# Altium project RK3576J-MB.PrjPCB (part 3 of 7)

## Sheet PWR_PoE_PD_1000BASE-T.SchDoc
size 420 x 297 mm; SheetNumber: 4; SheetTotal: 32; DocumentTypeShort: Э3; DocumentInvertoryNumber: ㅤ
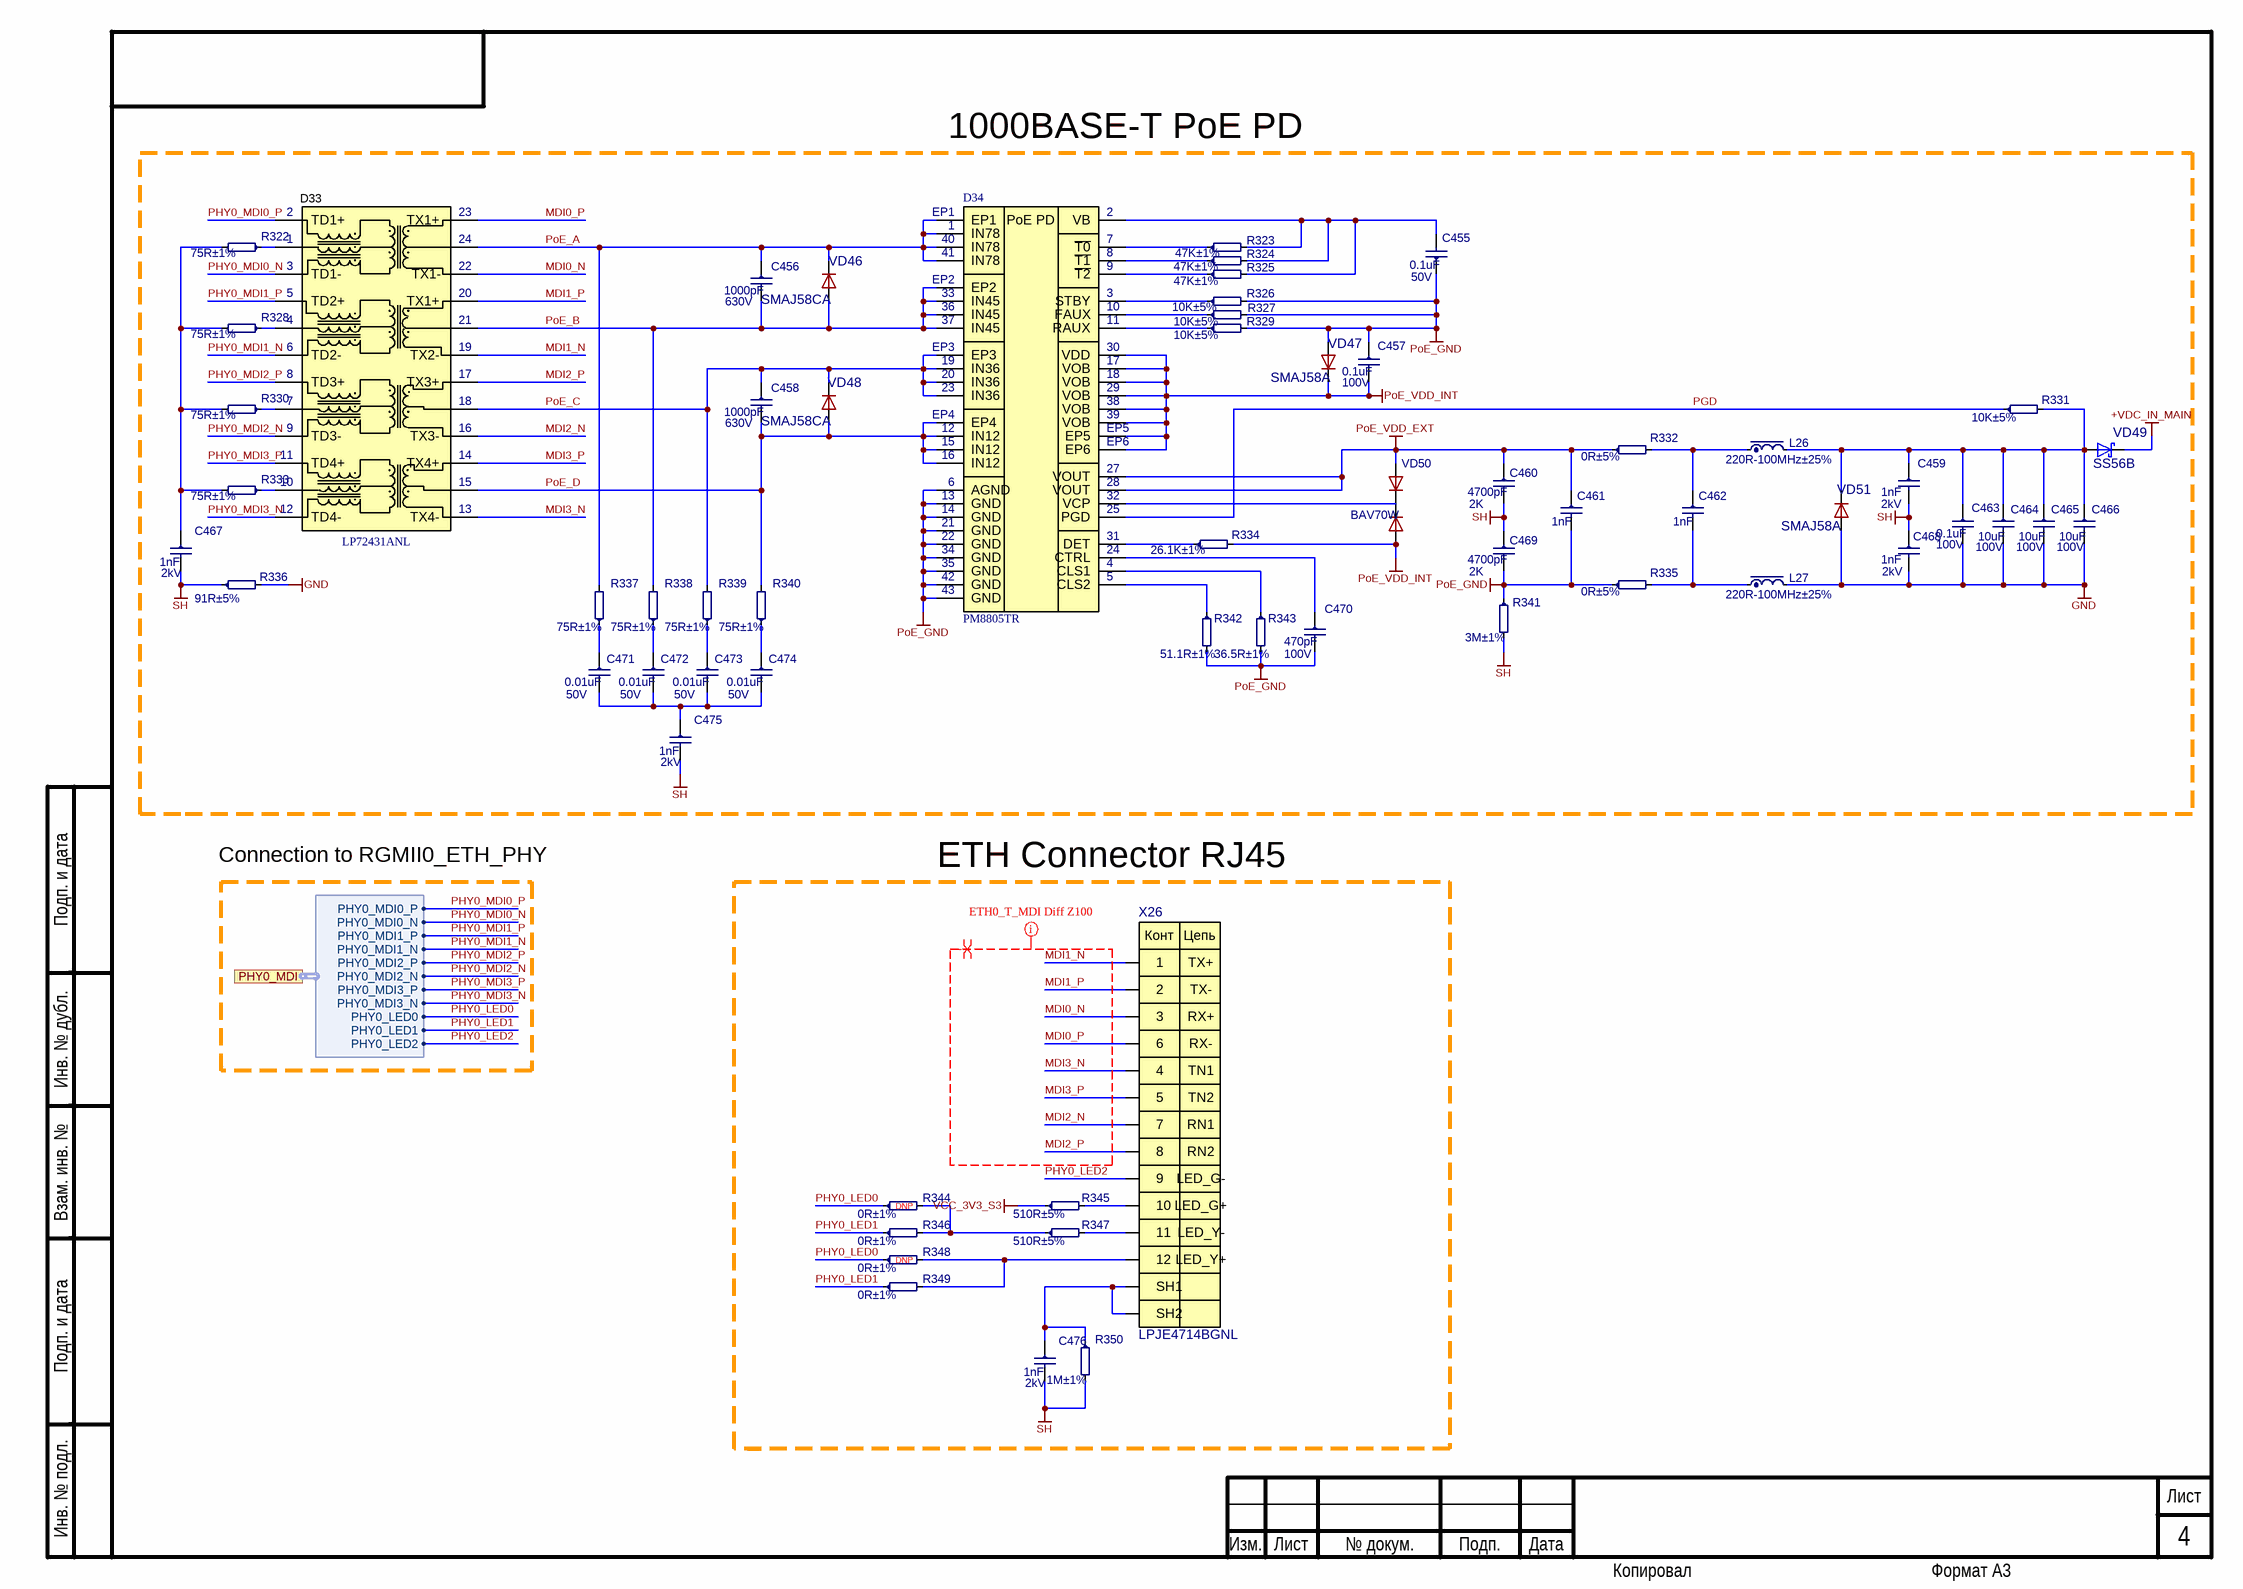
[diagram p6: PWR_PoE_PD_1000BASE-T.SchDoc]

### Parts
C455  0.1uF  Voltage: 50V  [C0603]
C456  1000pF  Voltage: 630V  [C1206]
C457  0.1uF  Voltage: 100V  [C1206]
C458  1000pF  Voltage: 630V  [C1206]
C459  1nF  Voltage: 2kV  [C1812]
C460  4700pF  Voltage: 2K  [C1206]
C461  1nF  [C1206]
C462  1nF  [C1206]
C463  0.1uF  Voltage: 100V  [C1206]
C464  10uF  Voltage: 100V  [C1210]
C465  10uF  Voltage: 100V  [C1210]
C466  10uF  Voltage: 100V  [C1210]
C467  1nF  Voltage: 2kV  [C1812]
C468  1nF  Voltage: 2kV  [C1812]
C469  4700pF  Voltage: 2K  [C1206]
C470  470pF  Voltage: 100V  [C0805]
C471  0.01uF  Voltage: 50V  [C0603]
C472  0.01uF  Voltage: 50V  [C0603]
C473  0.01uF  Voltage: 50V  [C0603]
C474  0.01uF  Voltage: 50V  [C0603]
C475  1nF  Voltage: 2kV  [C1812]
C476  1nF  Voltage: 2kV  [C1812]
D33  LP72431ANL  [LP72431ANL]
D34  PM8805TR  [PM8805TR]
L26  220R-100MHz±25%  [L0805]
L27  220R-100MHz±25%  [L0805]
R322  75R±1%  [R0603]
R323  47K±1%  [R0402]
R324  47K±1%  [R0402]
R325  47K±1%  [R0402]
R326  10K±5%  [R0402]
R327  10K±5%  [R0402]
R328  75R±1%  [R0603]
R329  10K±5%  [R0402]
R330  75R±1%  [R0603]
R331  10K±5%  [R1206]
R332  0R±5%  [R1206]
R333  75R±1%  [R0603]
R334  26.1K±1%  [R0603]
R335  0R±5%  [R1206]
R336  91R±5%  [R2010]
R337  75R±1%  [R0603]
R338  75R±1%  [R0603]
R339  75R±1%  [R0603]
R340  75R±1%  [R0603]
R341  3M±1%  [R1206]
R342  51.1R±1%  [R0805]
R343  36.5R±1%  [R0805]
R344  0R±1%  [R0402]
R345  510R±5%  [R0402]
R346  0R±1%  [R0402]
R347  510R±5%  [R0402]
R348  0R±1%  [R0402]
R349  0R±1%  [R0402]
R350  1M±1%  [R1206]
VD46  SMAJ58CA  [DO-214AC]
VD47  SMAJ58A  [DO-214AC]
VD48  SMAJ58CA  [DO-214AC]
VD49  SS56B  [DO-214AA]
VD50  BAV70W  [SOT323]
VD51  SMAJ58A  [DO-214AC]
X26  LPJE4714BGNL  [LPJE4714BGNL]

### Ports
PHY0_MDI (harness PHY0_MDI)

### Harnesses
PHY0_MDI: PHY0_MDI0_N, PHY0_MDI1_P, PHY0_MDI1_N, PHY0_MDI2_P, PHY0_MDI0_P, PHY0_MDI2_N, PHY0_MDI3_P, PHY0_MDI3_N, PHY0_LED0, PHY0_LED1, PHY0_LED2

### Nets
+VDC_IN_MAIN: VD49.1(K)
GND: C463.2 C464.2 C465.2 C466.2 C468.2 L27.2 R336.2 VD51.2(A)
PoE_GND: C455.1 C457.1 C461.2 C469.2 C470.2 D34.6(AGND) D34.13(GND) D34.14(GND) D34.21(GND) D34.22(GND) D34.34(GND) D34.35(GND) D34.42(GND) D34.43(GND) R326.2 R327.2 R329.2 R335.1 R341.1 R342.2 R343.2 VD47.2(A)
PoE_VDD_EXT: C460.1 C461.1 D34.27(VOUT) D34.28(VOUT) R332.1 VD50.1(A)
PoE_VDD_INT: C457.2 D34.17(VOB) D34.18(VOB) D34.29(VOB) D34.30(VDD) D34.38(VOB) D34.39(VOB) D34.EP5 D34.EP6 R334.2 VD47.1(C) VD50.2(A)
SH: C459.2 C460.2 C467.2 C468.1 C469.1 C475.2 C476.2 R336.1 R341.2 R350.2
VCC_3V3_S3: R345.1
MDI0_N: D33.22(TX1-) X26.3
MDI0_P: D33.23(TX1+) X26.6
MDI1_N: D33.19(TX2-) X26.1
MDI1_P: D33.20(TX1+) X26.2
MDI2_N: D33.16(TX3-) X26.7
MDI2_P: D33.17(TX3+) X26.8
MDI3_N: D33.13(TX4-) X26.4
MDI3_P: D33.14(TX4+) X26.5
PGD: D34.25(PGD) R331.1
PHY0_LED0: R344.1 R348.1 ; port PHY0_MDI.PHY0_LED0
PHY0_LED1: R346.1 R349.1 ; port PHY0_MDI.PHY0_LED1
PHY0_LED2: X26.9 ; port PHY0_MDI.PHY0_LED2
PHY0_MDI0_N: D33.3(TD1-) ; port PHY0_MDI.PHY0_MDI0_N  [project net PHY0_MDI.PHY0_MDI0_N]
PHY0_MDI0_P: D33.2(TD1+) ; port PHY0_MDI.PHY0_MDI0_P  [project net PHY0_MDI.PHY0_MDI0_P]
PHY0_MDI1_N: D33.6(TD2-) ; port PHY0_MDI.PHY0_MDI1_N  [project net PHY0_MDI.PHY0_MDI1_N]
PHY0_MDI1_P: D33.5(TD2+) ; port PHY0_MDI.PHY0_MDI1_P  [project net PHY0_MDI.PHY0_MDI1_P]
PHY0_MDI2_N: D33.9(TD3-) ; port PHY0_MDI.PHY0_MDI2_N  [project net PHY0_MDI.PHY0_MDI2_N]
PHY0_MDI2_P: D33.8(TD3+) ; port PHY0_MDI.PHY0_MDI2_P  [project net PHY0_MDI.PHY0_MDI2_P]
PHY0_MDI3_N: D33.12(TD4-) ; port PHY0_MDI.PHY0_MDI3_N  [project net PHY0_MDI.PHY0_MDI3_N]
PHY0_MDI3_P: D33.11(TD4+) ; port PHY0_MDI.PHY0_MDI3_P  [project net PHY0_MDI.PHY0_MDI3_P]
PoE_A: C456.1 D33.24(TCT_1) D34.1(IN78) D34.40(IN78) D34.41(IN78) D34.EP1 R337.2 VD46.1(C)
PoE_B: C456.2 D33.21(TCT_2) D34.33(IN45) D34.36(IN45) D34.37(IN45) D34.EP2 R338.2 VD46.2(A)
PoE_C: C458.1 D33.18(TCT_3) D34.19(IN36) D34.20(IN36) D34.23(IN36) D34.EP3 R339.2 VD48.1(C)
PoE_D: C458.2 D33.15(TCT_4) D34.12(IN12) D34.15(IN12) D34.16(IN12) D34.EP4 R340.2 VD48.2(A)
NetC455_2: C455.2 D34.2(VB) R323.2 R324.2 R325.2
NetC459_1: C459.1 C463.1 C464.1 C465.1 C466.1 L26.2 R331.2 VD49.2(A) VD51.1(C)
NetC462_1: C462.1 L26.1 R332.2
NetC462_2: C462.2 L27.1 R335.2
NetC467_1: C467.1 R322.2 R328.2 R330.2 R333.2
NetC470_1: C470.1 D34.24(CTRL)
NetC471_1: C471.1 R337.1
NetC471_2: C471.2 C472.2 C473.2 C474.2 C475.1
NetC472_1: C472.1 R338.1
NetC473_1: C473.1 R339.1
NetC474_1: C474.1 R340.1
NetC476_1: C476.1 R350.1 X26.SH1 X26.SH2
NetD33_1: D33.1(TCT1) R322.1
NetD33_4: D33.4(TCT2) R328.1
NetD33_7: D33.7(TCT3) R330.1
NetD33_10: D33.10(TCT4) R333.1
NetD34_3: D34.3(STBY) R326.1
NetD34_4: D34.4(CLS1) R343.1
NetD34_5: D34.5(CLS2) R342.1
NetD34_7: D34.7(~{T0}) R323.1
NetD34_8: D34.8(~{T1}) R324.1
NetD34_9: D34.9(~{T2}) R325.1
NetD34_10: D34.10(FAUX) R327.1
NetD34_11: D34.11(RAUX) R329.1
NetD34_31: D34.31(DET) R334.1
NetD34_32: D34.32(VCP) VD50.3(CC)
NetR344_2: R344.2 R346.2 R347.1
NetR345_2: R345.2 X26.10
NetR347_2: R347.2 X26.11
NetR348_2: R348.2 R349.2 X26.12

### Layout directives
net class T_MDI: MDI0_N, MDI0_P, MDI1_N, MDI1_P, MDI2_N, MDI2_P, MDI3_N, MDI3_P
differential pair; differential pair class Diff_Z100: MDI0_N, MDI0_P, MDI1_N, MDI1_P, MDI2_N, MDI2_P, MDI3_N, MDI3_P

### Notes on the sheet
- 1000BASE-T PoE PD
- Connection to RGMII0_ETH_PHY
- ETH Connector RJ45
- (near R344) DNP
- (near R348) DNP
- Подп. и дата
- Инв. № дубл.
- Взам. инв. №
- Инв. № подл.
- Изм.
- Лист
- № докум.
- Подп.
- Дата
- Копировал
- Формат А3
- (in symbol LPJE4714BGNL) Конт; Цепь; TX+; TX-; RX+; RX-; TN1; TN2; RN1; RN2; LED_G-; LED_G+; LED_Y-; LED_Y+
- (in symbol PM8805TR) PoE PD

### Library data of the parts
C455 = 0603-X7R-50V-0.1uF±10%: Manufacturer: Yageo; NameFromManufacturer: CC0603KRX7R9BB104; Dielectric: X7R; Place: *); Tolerance: 10%; Check: False; Case: C0603; Part Number: 0603-X7R-50V-0.1uF±10%; Value: 0.1uF; Temperature: -55°C~125°C; ComponentLink2Description: Link to datasheet; ComponentLink1Description: DATASHEET; ComponentLink2URL: https://www.yageo.com/upload/media/product/productsearch/datasheet/mlcc/UPY-GPHC_X7R_6.3V-to-50V_18.pdf; ComponentLink1URL: Datasheets/capacitors/UPY-GPHC_X7R_6.3V-to-50V_18.pdf; Last changed: 27.10.2022
C456 C458 = 1206-NP0-630V-1000pF±5%: Manufacturer: Yageo; NameFromManufacturer: AC1206JKNPOZBN102; Dielectric: NP0; Place: *); Tolerance: 5%; Check: False; Case: C1206; Part Number: 1206-NP0-630V-1000pF±5%; Value: 1000pF; Temperature: -55°C~125°C; ComponentLink2Description: Link to datasheet; ComponentLink1Description: DATASHEET; ComponentLink2URL: https://www.yageo.com/upload/media/product/productsearch/datasheet/mlcc/UPY-AC_NP0X7R_16V-to-630V_12.pdf; ComponentLink1URL: Datasheets/capacitors/grm1555c1h2r2ca01-01-6256770.pdf; Last changed: 27.10.2022
C457 C463 = 1206-X7R-100V-0.1uF±10%: Manufacturer: KEMET; NameFromManufacturer: C1206C104K1RAC7800; Dielectric: X7R; Place: *); Tolerance: 10%; Check: False; Case: C1206; Part Number: 1206-X7R-100V-0.1uF±10%; Value: 0.1uF; Temperature: -55°C~125°C; ComponentLink2Description: Link to datasheet; ComponentLink1Description: DATASHEET; ComponentLink2URL: https://ru.mouser.com/ProductDetail/KEMET/C1206C104K1RAC7800?qs=iEvsikg1EVxARPY%252B1Vujbw%3D%3D; ComponentLink1URL: Datasheets/capacitors/C1206C104K1RACTU.pdf; Last changed: 27.10.2022
C459 C467 C468 C475 C476 = 1812-C0G-2kV-1uF±10%: *; Part Number: 1812-C0G-2kV-1nF±10%; Manufacturer: FH; NameFromManufacturer: 1812B102K202NT; Dielectric: C0G; Place: *); Tolerance: 5%; Check: False; Case: CASE; Value: 1nF; Temperature: -55°C~125°C; ComponentLink2Description: Link to datasheet; ComponentLink1Description: DATASHEET; ComponentLink2URL: https://octopart.com/1812ga102jat2a-avx-75165070?r=sp; ComponentLink1URL: Datasheets/capacitors/C0GNP0-Dielectric.pdf; Last changed: 27.10.2022
C460 C469 = 1206-X7R-1K-4700pF±10%: Part Number: 1206-X7R-2K-4700pF±10%; Manufacturer: FH; NameFromManufacturer: 1206B472K202NT; Dielectric: X7R; Place: *); Tolerance: 10%; Check: False; Case: C1206; Value: 4700pF; Temperature: -55°C~125°C; ComponentLink2Description: Link to datasheet; ComponentLink1Description: DATASHEET; ComponentLink2URL: https://www.terraelectronica.ru/product/577491; ComponentLink1URL: Datasheets/capacitors/UPY-NP0X7R_HV_500V-to-3KV_15.pdf; Last changed: 27.10.2022
C461 C462 = 1206-X7R-2K-1000pF±10%: Ceramic Capacitor 1206 1nF ±10% 2kV X7R; Manufacturer: Yageo; NameFromManufacturer: CC1206KKX7RDBB102; Place: *); Analog: 1206B102K202; Check: False; Dielectric: X7R; Voltage: 2kV; Case: C1206; Part Number: 1206-X7R-2K-1000pF±10%; Value: 1nF; Tolerance: 10%; Temperature: -55°C~125°C; ComponentLink2Description: Link to datasheet; ComponentLink1Description: DATASHEET; ComponentLink2URL: https://www.lcsc.com/product-detail/Multilayer-Ceramic-Capacitors-MLCC-SMD-SMT_YAGEO-CC1206KKX7RDBB102_C23631.html; Last changed: 09.04.2025
C464-C466 = 1210-X7S-100V-10uF±10%: Manufacturer: Samsung Electro-Mechanics; NameFromManufacturer: CL32Y106KCVZNWE; Dielectric: X7S; Place: *); Tolerance: 10%; Check: False; Case: C1210; Part Number: 1210-X7S-100V-10uF±10%; Value: 10uF; Temperature: -55°C~125°C; ComponentLink2Description: Link to datasheet; ComponentLink1Description: DATASHEET; ComponentLink2URL: https://www.digikey.com/en/products/detail/samsung-electro-mechanics/CL32Y106KCVZNWE/15992073; ComponentLink1URL: Datasheets/capacitors/CL32Y106KCVZNWE_Spec.pdf; Last changed: 27.10.2022
C470 = 0805-X7R-16V-0.33uF±10%: Part Number: 0805-X7R-100V-470pF±10%; Manufacturer: Yageo; NameFromManufacturer: CC0805JRNPO0BN471; Dielectric: X7R; Place: *); Tolerance: 10%; Check: False; Case: C0805; Value: 470pF; Temperature: -55°C~125°C; ComponentLink2Description: Link to datasheet; ComponentLink1Description: DATASHEET; ComponentLink2URL: https://www.digikey.com/en/products/detail/yageo/CC0805KKX7R7BB334/5195288; ComponentLink1URL: Datasheets/capacitors/UPY-GPHC_X7R_6.3V-to-50V_20.pdf; Last changed: 27.10.2022
C471-C474 = 0603-X7R-50V-0.01uF±10%: Manufacturer: Yageo; NameFromManufacturer: CC0603KRX7R9BB103; Dielectric: X7R; Place: *); Tolerance: 10%; Check: False; Case: C0603; Part Number: 0603-X7R-50V-0.01uF±10%; Value: 0.01uF; Temperature: -55°C~125°C; ComponentLink2Description: Link to datasheet; ComponentLink1Description: DATASHEET; ComponentLink2URL: https://www.yageo.com/upload/media/product/productsearch/datasheet/mlcc/UPY-GPHC_X7R_6.3V-to-50V_18.pdf; ComponentLink1URL: Datasheets/capacitors/UPY-GPHC_X7R_6.3V-to-50V_20.pdf; Last changed: 27.10.2022
D33 = LP72431ANL: Manufacturer: LINK-PP; Check: False; ComponentType: *; Manufacter: *; Voltage: *; ClassName: *; Tolerance: *; PartNumber: LP72431ANL; Package: LP72431ANL; Part Number: LP72431ANL; NameFromManufacturer: LP72431ANL; Value: LP72431ANL
D34 = PM8805TR: Manufacturer: ST; Check: False; Part Number: PM8805TR; NameFromManufacturer: PM8805TR; Value: PM8805TR
L26 L27 = 0805-3A-120R-100MHz: *; Part Number: 0805-3A-220R-100MHz; Manufacturer: TDK; NameFromManufacturer: MPZ2012S221AT000; Current: 3A; Place: *); Tolerance: 25%; DC Resistance: 0.03R; Check: False; Case: L0805; Value: 220R-100MHz; Temperature: -55°C~125°C; ComponentLink1Description: DATASHEET; ComponentLink1URL: https://www.terraelectronica.ru/product/854541; Datasheet: Datasheets/inductors/QNFA9102.pdf; Last changed: 27.10.2022
R322 R328 R330 R333 R337-R340 = 0603-0.1W-75R-100ppm±1%: *; NameFromManufacturer: RC0603FR-0775RL; Manufacturer: Yageo; Place: *); Value: 75R; Tolerance: 1%; Check: False; Case: R0603; Part Number: 0603-0.1W-75R-100ppm±1%; Temperature: -55°C~155°C; ComponentLink1Description: DATASHEET; ComponentLink1URL: https://octopart.com/rc0603fr-0775rl-yageo-1432518?r=sp; Datasheet: Datasheets/resistors/RC0603.pdf; Last changed: 27.10.2022
R323-R325 = 0402-0.0625W-47K-100ppm±1%: NameFromManufacturer: RC0402FR-0747KL; Manufacturer: Yageo; Place: *); Value: 47K; Tolerance: 1%; Check: False; Case: R0402; Part Number: 0402-0.0625W-47K-100ppm±1%; Temperature: -55°C~155°C; ComponentLink1Description: DATASHEET; ComponentLink1URL: https://www.terraelectronica.ru/pdf/show?pdf_file=%252Fds%252Fpdf%252FR%252FRC0402.pdf; Datasheet: Datasheets/resistors/PYu-RC_Group_51_RoHS_L_12.pdf; Last changed: 27.10.2022
R326 R327 R329 = 0402-0.0625W-10K-100ppm±5%: NameFromManufacturer: RC0402JR-0710KL; Manufacturer: Yageo; Place: *); Value: 10K; Tolerance: 5%; Check: False; Case: R0402; Part Number: 0402-0.0625W-10K-100ppm±5%; Temperature: -55°C~155°C; ComponentLink1Description: DATASHEET; ComponentLink1URL: https://ru.mouser.com/ProductDetail/YAGEO/RC0402JR-0710KL?qs=%2Fha2pyFadugNN0LzwXn2qF8HRAp201xOpXu%252BapQnyvRGE%2F%252Bpr1TWjQ%3D%3D; Datasheet: Datasheets/resistors/PYu-RC_Group_51_RoHS_L_11.pdf; Last changed: 27.10.2022
R331 = 1206-0.25W-10K-100ppm±5%: NameFromManufacturer: RC1206JR-1310KL; Manufacturer: Yageo; Place: *); Value: 10K; Tolerance: 5%; Check: False; Case: R1206; Part Number: 1206-0.25W-10K-100ppm±5%; Temperature: -55°C~155°C; ComponentLink1Description: DATASHEET; ComponentLink1URL: https://www.digikey.com/en/products/detail/yageo/RC1206JR-1310KL/14286743; Datasheet: Datasheets/resistors/PYu-RC_Group_51_RoHS_L_11.pdf; Last changed: 27.10.2022
R332 R335 = 1206-0.25W-0R-200ppm±5%: NameFromManufacturer: RC1206JR-070RL; Manufacturer: Yageo; Place: *); Value: 0R; Tolerance: 5%; Check: False; Case: R1206; Part Number: 1206-0.25W-0R-200ppm±5%; Temperature: -55°C~155°C; ComponentLink1Description: DATASHEET; ComponentLink1URL: https://www.yageo.com/upload/media/product/productsearch/datasheet/rchip/PYu-RC_Group_51_RoHS_L_11.pdf; Datasheet: Datasheets/resistors/PYu-RC_Group_51_RoHS_L_11.pdf; Last changed: 27.10.2022
R334 = 0603-0.1W-26.1K-100ppm±1%: NameFromManufacturer: NRC06F2612TRF; Manufacturer: NIC Components Corp.; Place: *); Value: 26.1K; Tolerance: 1%; Check: False; Case: R0603; Part Number: 0603-0.1W-26.1K-100ppm±1%; Temperature: -55°C~155°C; ComponentLink1Description: DATASHEET; ComponentLink1URL: https://www.xonelec.com/mpn/nic/nrc06f2612trf; Datasheet: Datasheets/resistors/NRC06F2612TRF-datasheet-pdf-ru.findic.com.pdf#Datasheets\resistors\NRC06F2612TRF-datasheet-pdf-ru.findic.com.pdf#; Last changed: 07.11.2022
R336 = 2010-0.75W-0R-200ppm±5%: Chip Resistor 2010 0Ω ±5% 200V ±200ppm/℃ Thick Film; Part Number: 2010-0.75W-91R-200ppm±5%; NameFromManufacturer: CL2010JN91RB; Manufacturer: CHANGLONG; Place: *); Value: 91R; Check: False; Case: R2010; Tolerance: 5%; Temperature: -55°C~155°C; ComponentLink1Description: DATASHEET; ComponentLink1URL: https://www.lcsc.com/product-detail/Chip-Resistor-Surface-Mount_YAGEO-RC2010JK-070RL_C152156.html; Last changed: 16.07.2024
R341 = 1206-0.25W-1M-100ppm±1%: Chip Resistor 1206 3MΩ ±1% 200V ±100ppm/℃ Thick Film; Part Number: 1206-0.25W-3M-100ppm±1%; NameFromManufacturer: NQ06W4F3004T5E; Manufacturer: UNI-ROYAL; Place: *); Value: 3M; Check: False; Case: R1206; Tolerance: 1%; Temperature: -55°C~155°C; ComponentLink1Description: DATASHEET; ComponentLink1URL: https://www.lcsc.com/product-detail/Chip-Resistor-Surface-Mount_YAGEO-RC1206FR-071ML_C108083.html?s_z=n_RC1206FR-071ML; Last changed: 09.04.2025
R342 = 0805-0.125W-200R-100ppm±1%: Chip Resistor 0805 200Ω ±1% 150V ±100ppm/℃ Thick Film; Part Number: 0805-0.125W-51.1R-100ppm±1%; NameFromManufacturer: RT0805BRD0751R1L; Manufacturer: YAGEO; Place: *); Value: 51.1R; Check: False; Case: R0805; Tolerance: 1%; Temperature: -55°C~125°C; ComponentLink1Description: DATASHEET; ComponentLink1URL: https://www.lcsc.com/product-detail/Chip-Resistor-Surface-Mount_YAGEO-RC0805FR-07200RL_C114567.html; Datasheet: #Datasheets\resistors\WR08X3300FTL-datasheet-pdf-ru.findic.com.pdf#; Last changed: 07.11.2022
R343 = 0805-0.125W-200R-100ppm±1%: Chip Resistor 0805 200Ω ±1% 150V ±100ppm/℃ Thick Film; Part Number: 0805-0.125W-36.5R-100ppm±1%; NameFromManufacturer: 0805W8F365JT5E; Manufacturer: UNI-ROYAL; Place: *); Value: 36.5R; Check: False; Case: R0805; Tolerance: 1%; Temperature: -55°C~125°C; ComponentLink1Description: DATASHEET; ComponentLink1URL: https://www.lcsc.com/product-detail/Chip-Resistor-Surface-Mount_YAGEO-RC0805FR-07200RL_C114567.html; Datasheet: #Datasheets\resistors\WR08X3300FTL-datasheet-pdf-ru.findic.com.pdf#; Last changed: 07.11.2022
R344 R346 R348 R349 = 0402-0.0625W-0R-100ppm±1%: Chip Resistor 0402 0Ω ±1% 50V ±100ppm/℃ Thick Film; NameFromManufacturer: RC0402FR-070RL; Manufacturer: Yageo; Place: *); Value: 0R; Check: False; Case: R0402; Part Number: 0402-0.0625W-0R-100ppm±1%; Tolerance: 1%; Temperature: -55°C~155°C; ComponentLink1Description: DATASHEET; ComponentLink1URL: https://www.chipdip.ru/product0/8000617426?ysclid=l7og5x0plo427794326; Datasheet: Datasheets/resistors/DOC012445956.pdf; Last changed: 27.10.2022
R345 R347 = 0402-0.0625W-510R-100ppm±5%: NameFromManufacturer: RC0402JR-07510RL; Manufacturer: Yageo; Place: *); Value: 510R; Tolerance: 5%; Check: False; Case: R0402; Part Number: 0402-0.0625W-510R-100ppm±5%; Temperature: -55°C~155°C; ComponentLink1Description: DATASHEET; ComponentLink1URL: https://www.digikey.com/en/products/detail/yageo/RC0402JR-07510RL/726490; Datasheet: Datasheets/resistors/PYu-RC_Group_51_RoHS_L_11.pdf; Last changed: 27.10.2022
R350 = 1206-0.25W-1M-100ppm±1%: Chip Resistor 1206 1MΩ ±1% 200V ±100ppm/℃ Thick Film; NameFromManufacturer: RC1206FR-071ML; Manufacturer: Yageo; Place: *); Value: 1M; Check: False; Case: R1206; Part Number: 1206-0.25W-1M-100ppm±1%; Tolerance: 1%; Temperature: -55°C~155°C; ComponentLink1Description: DATASHEET; ComponentLink1URL: https://www.lcsc.com/product-detail/Chip-Resistor-Surface-Mount_YAGEO-RC1206FR-071ML_C108083.html?s_z=n_RC1206FR-071ML; Last changed: 09.04.2025
VD46-VD48 VD51 = SMAJ58AE3/TR13: surface mount 500 W Transient Voltage Suppressor; Manufacturer: Littelfuse; Place: *); Check: False; Temperature: -55°C~150°C; ComponentLink1Description: DATASHEET; ComponentLink1URL: https://ru.mouser.com/ProductDetail/Microchip-Technology/SMAJ58AE3-TR13?qs=pU29NIZ4ZwDTkSPRv5fxkg%3D%3D; Datasheet: Datasheets/diodes/smaj5.0_to_smaj440ca_rev_c.pdf; Last changed: 27.10.2022
  VD46 VD48: Part Number: SMAJ58CA; Value: SMAJ58CA; NameFromManufacturer: SMAJ58CA
  VD47 VD51: Part Number: SMAJ58A; Value: SMAJ58A; NameFromManufacturer: SMAJ58A
VD49 = B360BQ-13-F: Schottky Rectifier; Manufacturer: Yangjie (YJ); Place: S; Check: False; Part Number: SS56B; Value: SS56B; Temperature: -55°C~150°C; NameFromManufacturer: SS56B; Last changed: 27.10.2022
VD50 = BAV70W: 70V Dual Common Cathode 1V 6ns 200mA SOT-323 Switching Diode; Manufacturer: LRC; NameFromManufacturer: LBAV70WT1G; Place: *); Check: False; Part Number: BAV70W; Value: BAV70W; Temperature: -55°C~150°C; ComponentLink1Description: DATASHEET; ComponentLink1URL: https://www.lcsc.com/product-detail/Switching-Diode_LRC-LBAV70WT1G_C383182.html; Last changed: 04.07.2024; Analog: BAV70W
X26 = LPJE4714BGNL: Manufacturer: LINK-PP; Check: False; Part Number: LPJE4714BGNL; Value: LPJE4714BGNL; NameFromManufacturer: LPJE4714BGNL

## Sheet PWR_CORE.SchDoc
size 420 x 297 mm; Scale: 1:1; DocumentType: Схема электрическая принципиальная; SheetNumber: 6; SheetTotal: 31; DocumentTypeShort: Э3; DocumentInvertoryNumber: ㅤ
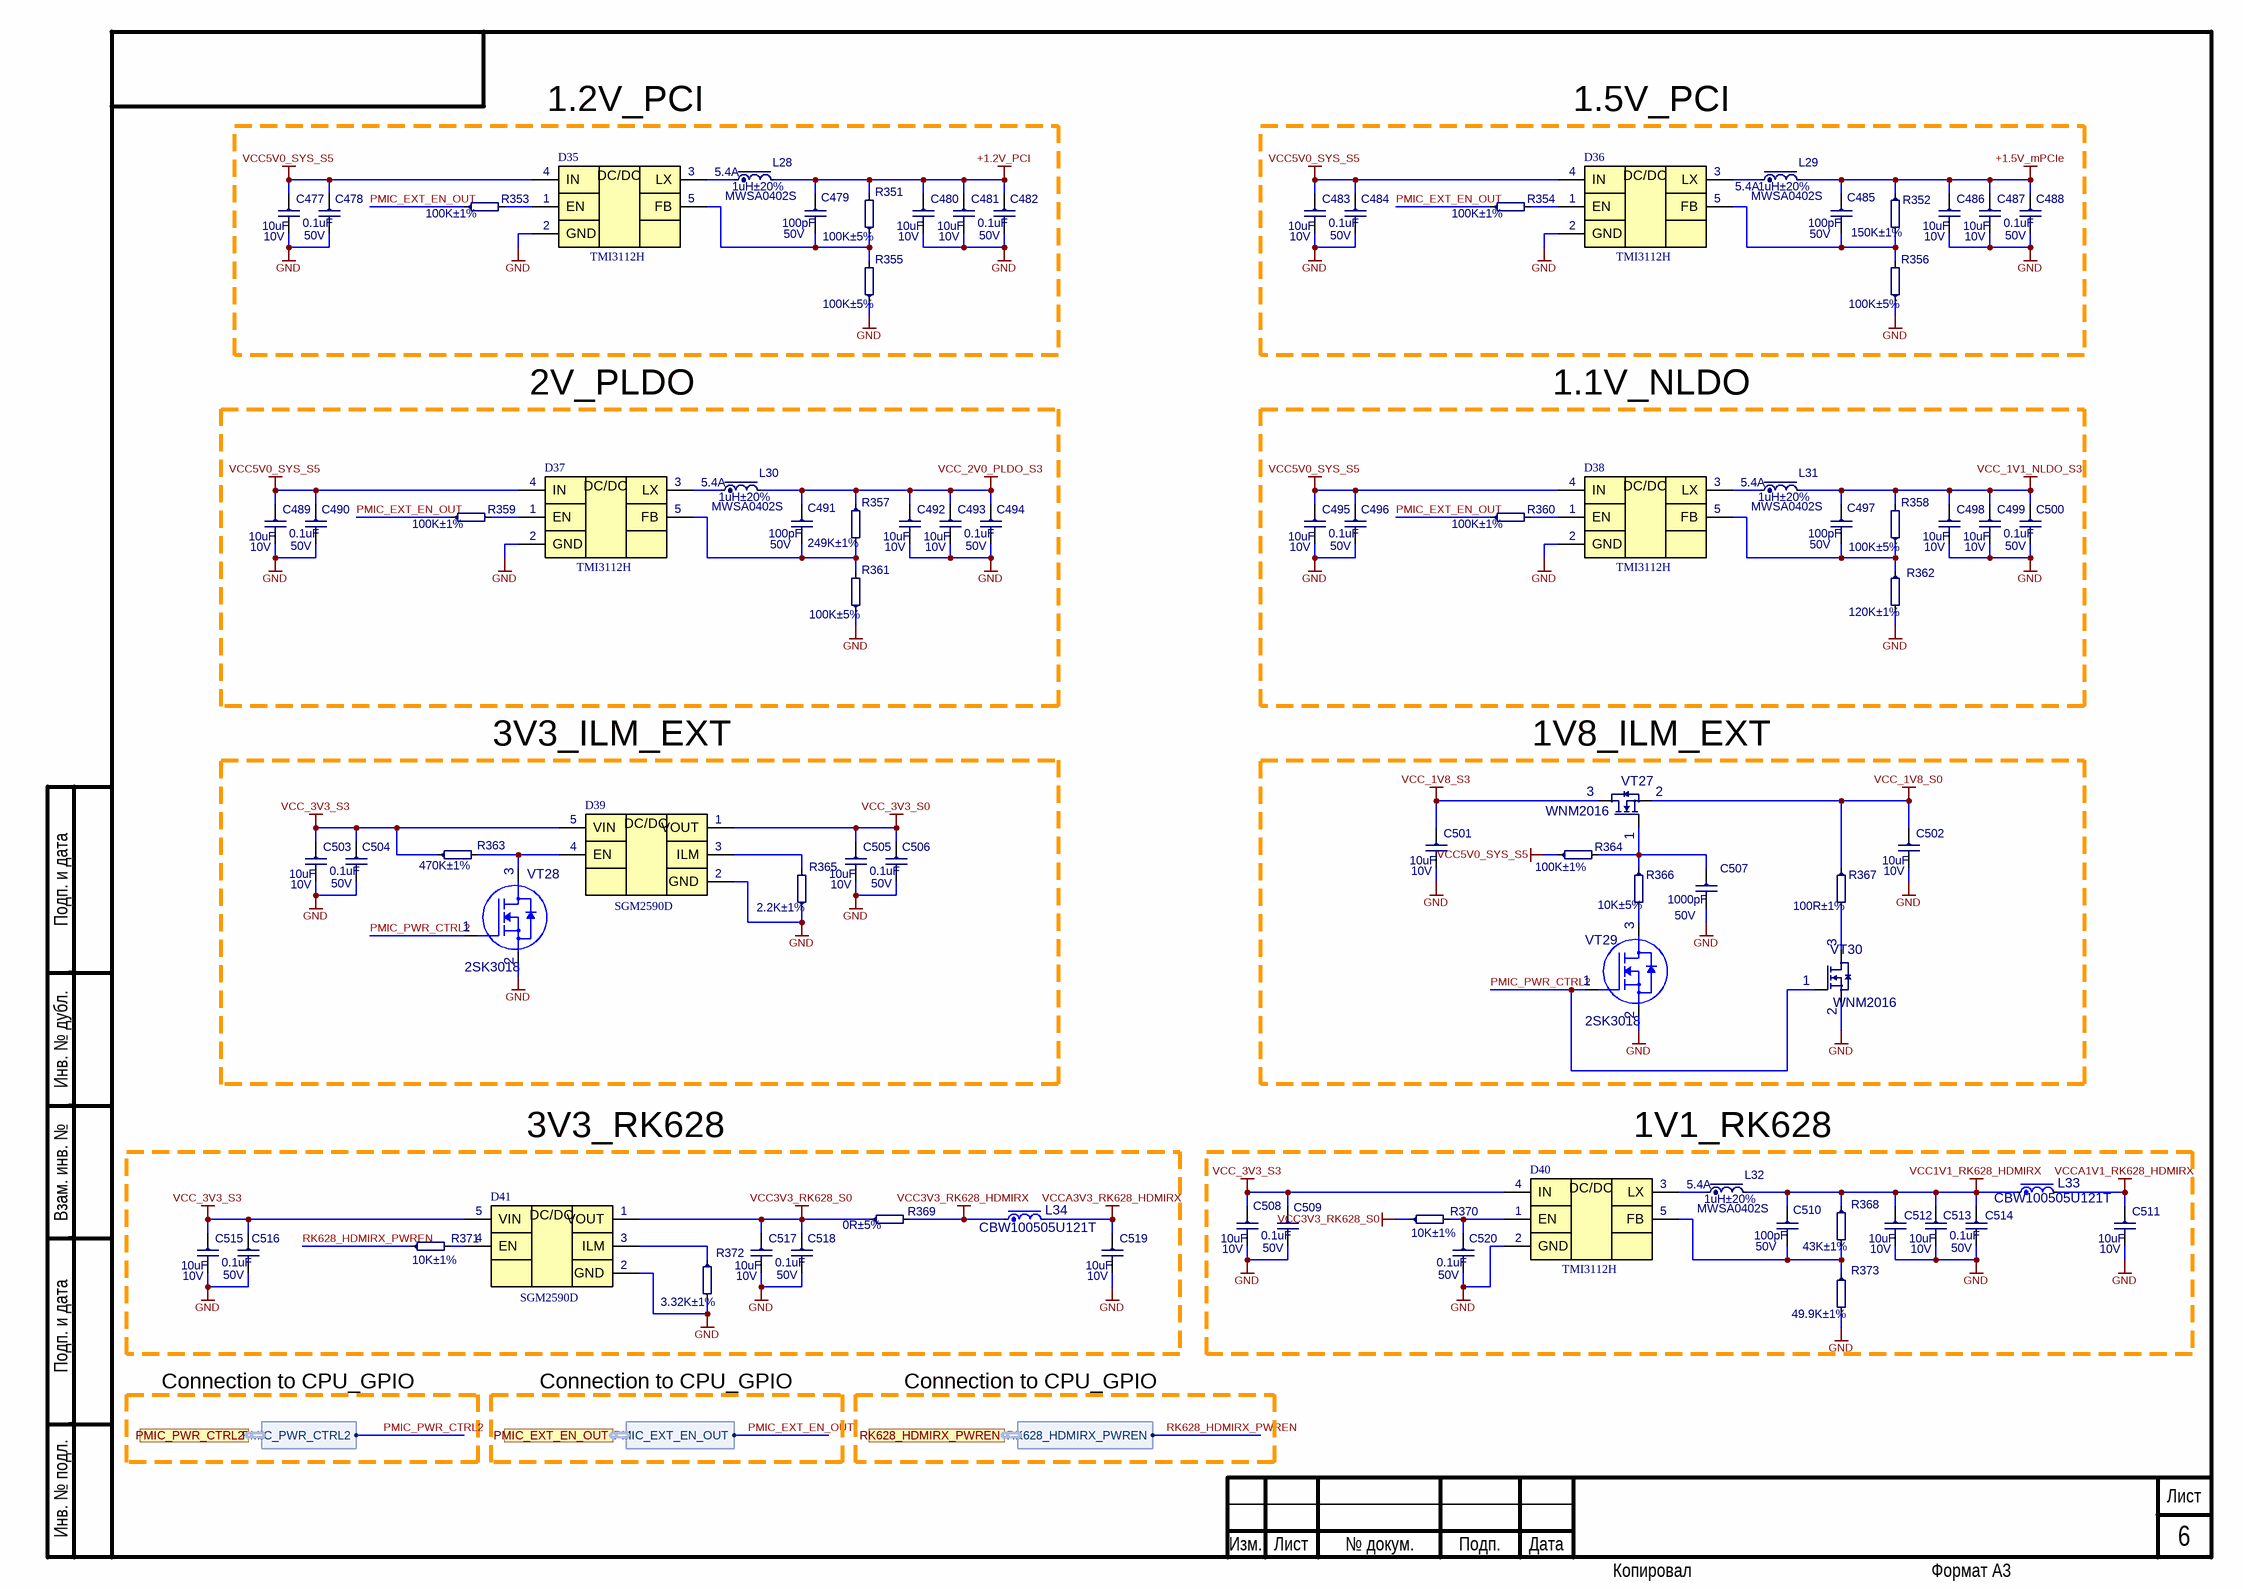
[diagram p7: PWR_CORE.SchDoc]

### Parts
C477  10uF  Voltage: 10V  [C0603]
C478  0.1uF  Voltage: 50V  [C0402]
C479  100pF  Voltage: 50V  [C0402]
C480  10uF  Voltage: 10V  [C0603]
C481  10uF  Voltage: 10V  [C0603]
C482  0.1uF  Voltage: 50V  [C0402]
C483  10uF  Voltage: 10V  [C0603]
C484  0.1uF  Voltage: 50V  [C0402]
C485  100pF  Voltage: 50V  [C0402]
C486  10uF  Voltage: 10V  [C0603]
C487  10uF  Voltage: 10V  [C0603]
C488  0.1uF  Voltage: 50V  [C0402]
C489  10uF  Voltage: 10V  [C0603]
C490  0.1uF  Voltage: 50V  [C0402]
C491  100pF  Voltage: 50V  [C0402]
C492  10uF  Voltage: 10V  [C0603]
C493  10uF  Voltage: 10V  [C0603]
C494  0.1uF  Voltage: 50V  [C0402]
C495  10uF  Voltage: 10V  [C0603]
C496  0.1uF  Voltage: 50V  [C0402]
C497  100pF  Voltage: 50V  [C0402]
C498  10uF  Voltage: 10V  [C0603]
C499  10uF  Voltage: 10V  [C0603]
C500  0.1uF  Voltage: 50V  [C0402]
C501  10uF  Voltage: 10V  [C0603]
C502  10uF  Voltage: 10V  [C0603]
C503  10uF  Voltage: 10V  [C0603]
C504  0.1uF  Voltage: 50V  [C0402]
C505  10uF  Voltage: 10V  [C0603]
C506  0.1uF  Voltage: 50V  [C0402]
C507  1000pF  Voltage: 50V  [C0402]
C508  10uF  Voltage: 10V  [C0603]
C509  0.1uF  Voltage: 50V  [C0402]
C510  100pF  Voltage: 50V  [C0402]
C511  10uF  Voltage: 10V  [C0603]
C512  10uF  Voltage: 10V  [C0603]
C513  10uF  Voltage: 10V  [C0603]
C514  0.1uF  Voltage: 50V  [C0402]
C515  10uF  Voltage: 10V  [C0603]
C516  0.1uF  Voltage: 50V  [C0402]
C517  10uF  Voltage: 10V  [C0603]
C518  0.1uF  Voltage: 50V  [C0402]
C519  10uF  Voltage: 10V  [C0603]
C520  0.1uF  Voltage: 50V  [C0402]
D35  TMI3112H  [TMI3112H]
D36  TMI3112H  [TMI3112H]
D37  TMI3112H  [TMI3112H]
D38  TMI3112H  [TMI3112H]
D39  SGM2590D  [SGM2590D]
D40  TMI3112H  [TMI3112H]
D41  SGM2590D  [SGM2590D]
L28  1uH±20%  Current: 5.4A  [MWSA0402S]
L29  1uH±20%  Current: 5.4A  [MWSA0402S]
L30  1uH±20%  Current: 5.4A  [MWSA0402S]
L31  1uH±20%  Current: 5.4A  [MWSA0402S]
L32  1uH±20%  Current: 5.4A  [MWSA0402S]
L33  CBW100505U121T  [L0402]
L34  CBW100505U121T  [L0402]
R351  100K±5%  [R0402]
R352  150K±1%  [R0402]
R353  100K±1%  [R0402]
R354  100K±1%  [R0402]
R355  100K±5%  [R0402]
R356  100K±5%  [R0402]
R357  249K±1%  [R0402]
R358  100K±5%  [R0402]
R359  100K±1%  [R0402]
R360  100K±1%  [R0402]
R361  100K±5%  [R0402]
R362  120K±1%  [R0402]
R363  470K±1%  [R0402]
R364  100K±1%  [R0402]
R365  2.2K±1%  [R0402]
R366  10K±5%  [R0402]
R367  100R±1%  [R0402]
R368  43K±1%  [R0402]
R369  0R±5%  [R0603]
R370  10K±1%  [R0402]
R371  10K±1%  [R0402]
R372  3.32K±1%  [R0603]
R373  49.9K±1%  [R0402]
VT27  WNM2016  [SOT23]
VT28  2SK3018  [2SK3018]
VT29  2SK3018  [2SK3018]
VT30  WNM2016  [SOT23]

### Ports
PMIC_EXT_EN_OUT (harness PMIC_EXT_EN_OUT), PMIC_PWR_CTRL2 (harness PMIC_PWR_CTRL2), RK628_HDMIRX_PWREN (harness RK628_HDMIRX_PWREN)

### Harnesses
PMIC_PWR_CTRL2: PMIC_PWR_CTRL2
PMIC_EXT_EN_OUT: PMIC_EXT_EN_OUT
RK628_HDMIRX_PWREN: RK628_HDMIRX_PWREN

### Nets
+1.2V_PCI: C479.1 C480.1 C481.1 C482.1 L28.2 R351.2
+1.5V_mPCIe: C485.1 C486.1 C487.1 C488.1 L29.2 R352.1
GND: C477.2 C478.2 C480.2 C481.2 C482.2 C483.2 C484.2 C486.2 C487.2 C488.2 C489.2 C490.2 C492.2 C493.2 C494.2 C495.2 C496.2 C498.2 C499.2 C500.2 C501.2 C502.2 C503.2 C504.2 C505.2 C506.2 C507.2 C508.2 C509.2 C511.2 C512.2 C513.2 C514.2 C515.2 C516.2 C517.2 C518.2 C519.2 C520.2 D35.2(GND) D36.2(GND) D37.2(GND) D38.2(GND) D39.2(GND) D40.2(GND) D41.2(GND) R355.1 R356.1 R361.1 R362.2 R365.1 R372.2 R373.2 VT28.2(S) VT29.2(S) VT30.2(S)
VCC1V1_RK628_HDMIRX: C510.1 C512.1 C513.1 C514.1 L32.2 L33.1 R368.1
VCC3V3_RK628_HDMIRX: L34.1 R369.2
VCC3V3_RK628_S0: C517.1 C518.1 D41.1(VOUT) R369.1 R370.1
VCC5V0_SYS_S5: C477.1 C478.1 C483.1 C484.1 C489.1 C490.1 C495.1 C496.1 D35.4(IN) D36.4(IN) D37.4(IN) D38.4(IN) R364.1
VCC_1V1_NLDO_S3: C497.1 C498.1 C499.1 C500.1 L31.2 R358.2
VCC_1V8_S0: C502.1 R367.1 VT27.2(S)
VCC_1V8_S3: C501.1 VT27.3(D)
VCC_2V0_PLDO_S3: C491.1 C492.1 C493.1 C494.1 L30.2 R357.1
VCC_3V3_S0: C505.1 C506.1 D39.1(VOUT)
VCC_3V3_S3: C503.1 C504.1 C508.1 C509.1 C515.1 C516.1 D39.5(VIN) D40.4(IN) D41.5(VIN) R363.1
VCCA1V1_RK628_HDMIRX: C511.1 L33.2
VCCA3V3_RK628_HDMIRX: C519.1 L34.2
PMIC_EXT_EN_OUT: R353.1 R354.1 R359.1 R360.1 ; port PMIC_EXT_EN_OUT.PMIC_EXT_EN_OUT
PMIC_PWR_CTRL2: VT28.1(G) VT29.1(G) VT30.1(G) ; port PMIC_PWR_CTRL2.PMIC_PWR_CTRL2
RK628_HDMIRX_PWREN: R371.1 ; port RK628_HDMIRX_PWREN.RK628_HDMIRX_PWREN
NetC479_2: C479.2 D35.5(FB) R351.1 R355.2
NetC485_2: C485.2 D36.5(FB) R352.2 R356.2
NetC491_2: C491.2 D37.5(FB) R357.2 R361.2
NetC497_2: C497.2 D38.5(FB) R358.1 R362.1
NetC507_1: C507.1 R364.2 R366.1 VT27.1(G)
NetC510_2: C510.2 D40.5(FB) R368.2 R373.1
NetC520_1: C520.1 D40.1(EN) R370.2
NetD35_1: D35.1(EN) R353.2
NetD35_3: D35.3(LX) L28.1
NetD36_1: D36.1(EN) R354.2
NetD36_3: D36.3(LX) L29.1
NetD37_1: D37.1(EN) R359.2
NetD37_3: D37.3(LX) L30.1
NetD38_1: D38.1(EN) R360.2
NetD38_3: D38.3(LX) L31.1
NetD39_3: D39.3(ILM) R365.2
NetD39_4: D39.4(EN) R363.2 VT28.3(D)
NetD40_3: D40.3(LX) L32.1
NetD41_3: D41.3(ILM) R372.1
NetD41_4: D41.4(EN) R371.2
NetR366_2: R366.2 VT29.3(D)
NetR367_2: R367.2 VT30.3(D)

### Notes on the sheet
- 1.2V_PCI
- 1.5V_PCI
- 2V_PLDO
- 1.1V_NLDO
- 3V3_ILM_EXT
- (near VT27) 1V8_ILM_EXT
- 3V3_RK628
- 1V1_RK628
- Connection to CPU_GPIO
- Подп. и дата
- Инв. № дубл.
- Взам. инв. №
- Инв. № подл.
- Изм.
- Лист
- № докум.
- Подп.
- Дата
- Копировал
- Формат А3
- (in symbol SGM2590D) DC/DC
- (in symbol TMI3112H) DC/DC

### Library data of the parts
C477 C480 C481 C483 C486 C487 C489 C492 C493 C495 C498 C499 C501-C503 C505 C508 C511-C513 C515 C517 C519 = 0603-X5R-10V-10uF±10%: *; Manufacturer: Yageo; NameFromManufacturer: CC0603KRX5R6BB106; Dielectric: X5R; Place: *); Tolerance: 10%; Check: False; Case: C0603; Part Number: 0603-X5R-10V-10uF±10%; Value: 10uF; Temperature: -55°C~85°C; ComponentLink2Description: Link to datasheet; ComponentLink1Description: DATASHEET; ComponentLink2URL: https://www.yageo.com/upload/media/product/productsearch/datasheet/mlcc/UPY-GPHC_X5R_4V-to-50V_26.pdf; ComponentLink1URL: Datasheets/capacitors/UPY-GPHC_X5R_4V-to-50V_26.pdf; Last changed: 27.10.2022
C478 C482 C484 C488 C490 C494 C496 C500 C504 C506 C509 C514 C516 C518 C520 = 0402-X5R-50V-0.1uF±10%: Manufacturer: Yageo; NameFromManufacturer: CC0402KRX5R9BB104; Dielectric: X5R; Place: *); Tolerance: 10%; Check: False; Case: C0402; Part Number: 0402-X5R-50V-0.1uF±10%; Value: 0.1uF; Temperature: -55°C~85°C; ComponentLink2Description: Link to datasheet; ComponentLink1Description: DATASHEET; ComponentLink2URL: https://www.yageo.com/upload/media/product/productsearch/datasheet/mlcc/UPY-GPHC_X5R_4V-to-50V_26.pdf; ComponentLink1URL: Datasheets/capacitors/UPY-GPHC_X5R_4V-to-50V_26.pdf; Last changed: 27.10.2022
C479 C485 C491 C497 C510 = 0402-NP0-50V-100pF±5%: *; Manufacturer: Yageo; NameFromManufacturer: CC0402JRNPO9BN101; Dielectric: NP0; Place: *); Tolerance: 5%; Check: False; Case: C0402; Part Number: 0402-NP0-50V-100pF±5%; Value: 100pF; Temperature: -55°C~125°C; ComponentLink2Description: Link to datasheet; ComponentLink1Description: DATASHEET; ComponentLink2URL: https://www.terraelectronica.ru/product/367375; ComponentLink1URL: Datasheets/capacitors/UPY-GP_NP0_16V-to-50V_18.pdf; Last changed: 27.10.2022
C507 = 0402-NP0-50V-1000pF±5%: Manufacturer: Yageo; NameFromManufacturer: CC0402JRNPO9BN102; Dielectric: NP0; Place: *); Tolerance: 5%; Check: False; Case: C0402; Part Number: 0402-NP0-50V-1000pF±5%; Value: 1000pF; Temperature: -55°C~125°C; ComponentLink2Description: Link to datasheet; ComponentLink1Description: DATASHEET; ComponentLink2URL: https://www.terraelectronica.ru/product/2101763; ComponentLink1URL: Datasheets/capacitors/UPY-GP_NP0_16V-to-50V_18.pdf; Last changed: 27.10.2022
D35-D38 D40 = TMI3112H: Buck 2.3MHz Adjustable 2A 600mV~5.5V SOT-23-5 Voltage Regulators - DC DC Switching Regulators RoHS; Manufacturer: TMI; Check: False; Part Number: TMI3112H; NameFromManufacturer: TMI3112H; Value: TMI3112H
D39 D41 = SGM2590D: Manufacturer: SGM; Check: False; Part Number: SGM2590D; NameFromManufacturer: SGM2590D; Value: SGM2590D
L28-L32 = MWSA0402S-1R0MT: 5.4A 1uH ±20% 5.6A SMD 4.4x4.2mm Power Inductor; Manufacturer: Sunlord; Place: *); DC Resistance: 0.27; Check: False; Case: MWSA0402S; Part Number: MWSA0402S-1R0MT; Value: 1uH; Tolerance: 20%; Temperature: -40°C~125°C; ComponentLink1Description: DATASHEET; NameFromManufacturer: MWSA0402S-1R0MT; ComponentLink1URL: https://www.electronshik.ru/item/SUNLORD/MWSA0402S-1R0MT; Last changed: 22.04.2025
L33 L34 = BLM15EG121SN1D: 120Ω@100MHz  Ferrite Beads; Manufacturer: Murata Electronics; Place: S; Tolerance: 25%; DC Resistance: 0.095R; Check: False; Analog: UPZ1005D121-1R3TF, CBW100505U121T, BLM15EG121SN1D; Part Number: CBW100505U121T; Value: CBW100505U121T; Temperature: -40°C~85°C; NameFromManufacturer: CBW100505U121T; Last changed: 18.04.2023
R351 R355 R356 R358 R361 = 0402-0.0625W-100K-100ppm±5%: NameFromManufacturer: RC0402JR-07100KL; Manufacturer: Yageo; Place: *); Value: 100K; Tolerance: 5%; Check: False; Case: R0402; Part Number: 0402-0.0625W-100K-100ppm±5%; Temperature: -55°C~155°C; ComponentLink1Description: DATASHEET; ComponentLink1URL: https://ru.mouser.com/ProductDetail/YAGEO/RC0402JR-07100KL?qs=%2Fha2pyFadugNN0LzwXn2qCsICuw6vgLBeLL%252BmXUKy2OLGS9kgqrNBA%3D%3D; Datasheet: Datasheets/resistors/PYu-RC_Group_51_RoHS_L_11.pdf; Last changed: 27.10.2022
R352 = 0402-0.0625W-150K-100ppm±1%: NameFromManufacturer: RC0402FR-07150KL; Manufacturer: Yageo; Place: *); Value: 150K; Tolerance: 1%; Check: False; Case: R0402; Part Number: 0402-0.0625W-150K-100ppm±1%; Temperature: -55°C~155°C; ComponentLink1Description: DATASHEET; ComponentLink1URL: https://www.yageo.com/upload/media/product/productsearch/datasheet/rchip/PYu-RC_Group_51_RoHS_L_11.pdf; Datasheet: Datasheets/resistors/PYu-RC_Group_51_RoHS_L_11.pdf; Last changed: 27.10.2022
R353 R354 R359 R360 R364 = 0402-0.0625W-100K-100ppm±1%: Chip Resistor 0402 100kΩ ±1% 50V ±100ppm/℃ Thick Film; NameFromManufacturer: RC0402FR-07100KL; Manufacturer: Yageo; Place: *); Value: 100K; Check: False; Case: R0402; Part Number: 0402-0.0625W-100K-100ppm±1%; Tolerance: 1%; Temperature: -55°C~155°C; ComponentLink1Description: DATASHEET; ComponentLink1URL: https://www.yageo.com/upload/media/product/productsearch/datasheet/rchip/PYu-RC_Group_51_RoHS_L_11.pdf; Datasheet: Datasheets/resistors/PYu-RC_Group_51_RoHS_L_11.pdf; Last changed: 27.10.2022
R357 = 0402-0.0625W-249K-100ppm±1%: NameFromManufacturer: RC0402FR-07249KL; Manufacturer: Yageo; Place: *); Value: 249K; Tolerance: 1%; Check: False; Case: R0402; Part Number: 0402-0.0625W-249K-100ppm±1%; Temperature: -55°C~155°C; ComponentLink1Description: DATASHEET; ComponentLink1URL: https://lcsc.com/product-detail/Chip-Resistor-Surface-Mount_YAGEO-RC0402FR-07249KL_C163476.html; Datasheet: Datasheets/resistors/PYu-RC_Group_51_RoHS_L_12.pdf#Datasheets/resistors/PYu-RC_Group_51_RoHS_L_12.pdf#; Last changed: 09.11.2022
R362 = 0402-0.0625W-120K-100ppm±1%: NameFromManufacturer: RC0402FR-07120KL; Manufacturer: Yageo; Place: *); Value: 120K; Tolerance: 1%; Check: False; Case: R0402; Part Number: 0402-0.0625W-120K-100ppm±1%; Temperature: -55°C~155°C; ComponentLink1Description: DATASHEET; ComponentLink1URL: https://eu.mouser.com/ProductDetail/YAGEO/RC0402FR-07120KL?qs=sxZXDnvRBEiD8SsZ%252BM9D1g%3D%3D; Datasheet: Datasheets/resistors/PYu-RC_Group_51_RoHS_L_11.pdf; Last changed: 27.10.2022
R363 = 0402-0.0625W-470K-100ppm±1%: *; NameFromManufacturer: RC0402FR-07470KL; Manufacturer: Yageo; Place: *); Value: 470K; Tolerance: 1%; Check: False; Case: R0402; Part Number: 0402-0.0625W-470K-100ppm±1%; Temperature: -55°C~155°C; ComponentLink1Description: DATASHEET; ComponentLink1URL: https://www.digikey.com/en/products/detail/yageo/RC0402FR-07470KL/726618?s=N4IgTCBcDaIEoGEAMAWJYBicC0SDsKeSA0gDIgC6AvkA; Datasheet: Datasheets/resistors/PYu-RC_Group_51_RoHS_L_11.pdf; Last changed: 27.10.2022
R365 = 0402-0.0625W-2.2K-100ppm±1%: *; NameFromManufacturer: RC0402FR-072K2L; Manufacturer: Yageo; Place: *); Value: 2.2K; Tolerance: 1%; Check: False; Case: R0402; Part Number: 0402-0.0625W-2.2K-100ppm±1%; Temperature: -55°C~155°C; ComponentLink1Description: DATASHEET; ComponentLink1URL: https://www.compel.ru/infosheet/YAG/SR0402FR-072K2L; Datasheet: Datasheets/resistors/PYu-SR_D_F tol_RoHS_L_5.pdf; Last changed: 27.10.2022
R366 = 0402-0.0625W-10K-100ppm±5%: as R326 on sheet PWR_PoE_PD_1000BASE-T; Case: R0402; Part Number: 0402-0.0625W-10K-100ppm±5%; Temperature: -55°C~155°C; ComponentLink1Description: DATASHEET; ComponentLink1URL: https://ru.mouser.com/ProductDetail/YAGEO/RC0402JR-0710KL?qs=%2Fha2pyFadugNN0LzwXn2qF8HRAp201xOpXu%252BapQnyvRGE%2F%252Bpr1TWjQ%3D%3D; Datasheet: Datasheets/resistors/PYu-RC_Group_51_RoHS_L_11.pdf; Last changed: 27.10.2022
R367 = 0402-0.0625W-100R-100ppm±1%: Chip Resistor 0402 100Ω ±1% 50V ±100ppm/℃ Thick Film; NameFromManufacturer: RC0402FR-07100RL; Manufacturer: Yageo; Place: *); Value: 100R; Check: False; Case: R0402; Part Number: 0402-0.0625W-100R-100ppm±1%; Tolerance: 1%; Temperature: -55°C~155°C; ComponentLink1Description: DATASHEET; ComponentLink1URL: https://www.yageo.com/upload/media/product/productsearch/datasheet/rchip/PYu-RC_Group_51_RoHS_L_11.pdf; Datasheet: Datasheets/resistors/PYu-RC_Group_51_RoHS_L_11.pdf; Last changed: 27.10.2022
R368 = 0402-0.0625W-43K-100ppm±1%: NameFromManufacturer: RC0402FR-0743KL; Manufacturer: Yageo; Place: *); Value: 43K; Tolerance: 1%; Check: False; Case: R0402; Part Number: 0402-0.0625W-43K-100ppm±1%; Temperature: -55°C~155°C; ComponentLink1Description: DATASHEET; ComponentLink1URL: https://www.compel.ru/infosheet/YAG/RC0402FR-0743KL; Datasheet: Datasheets/resistors/PYu-RC_Group_51_RoHS_L_11.pdf; Last changed: 27.10.2022
R369 = 0603-0.1W-0R-100ppm±5%: Chip Resistor 0603 0Ω ±5% 50V ±100ppm/℃ Thick Film; NameFromManufacturer: RC0603JR-070RL; Manufacturer: Yageo; Place: *); Value: 0R; Check: False; Case: R0603; Part Number: 0603-0.1W-0R-100ppm±5%; Tolerance: 5%; Temperature: -55°C~155°C; ComponentLink1Description: DATASHEET; ComponentLink1URL: https://www.chipdip.ru/product/0.1w-0603-0-om-5; Datasheet: Datasheets/resistors/PYu-RC_Group_51_RoHS_L_11.pdf; Last changed: 27.10.2022
R370 R371 = 0402-0.0625W-10K-100ppm±1%: Chip Resistor 0402 10kΩ ±1% 50V ±100ppm/℃ Thick Film; NameFromManufacturer: RC0402FR-0710KL; Manufacturer: Yageo; Place: *); Value: 10K; Check: False; Case: R0402; Part Number: 0402-0.0625W-10K-100ppm±1%; Tolerance: 1%; Temperature: -55°C~155°C; ComponentLink1Description: DATASHEET; ComponentLink1URL: https://ru.mouser.com/ProductDetail/YAGEO/RC0402FR-0710KL?qs=%2Fha2pyFaduhjtLcYvKXQ8IogF7YwN7YtH%252BOO8ZtEEMnoa4yoWYcwpw%3D%3D; Datasheet: Datasheets/resistors/PYu-RC_Group_51_RoHS_L_11.pdf; Last changed: 27.10.2022
R372 = 0603-0.1W-3.32K-100ppm±1%: NameFromManufacturer: CR-03FL7---3K3; Manufacturer: Viking Tech Corp.(VIKING); Place: *); Value: 3.32K; Tolerance: 1%; Check: False; Case: R0603; Part Number: 0603-0.1W-3.32K-100ppm±1%; Temperature: -55°C~155°C; ComponentLink1Description: DATASHEET; ComponentLink1URL: https://www.terraelectronica.ru/product/2782044; Datasheet: Datasheets/resistors/CR_SERIES.pdf; Last changed: 27.10.2022
R373 = 0402-0.0625W-49.9K-100ppm±1%: Chip Resistor 0402 49.9kΩ ±1% 50V ±100ppm/℃ Thick Film; NameFromManufacturer: RC0402FR-0749K9L; Manufacturer: Yageo; Place: *); Value: 49.9K; Check: False; Case: R0402; Part Number: 0402-0.0625W-49.9K-100ppm±1%; Tolerance: 1%; Temperature: -55°C~155°C; ComponentLink1Description: DATASHEET; ComponentLink1URL: https://www.terraelectronica.ru/product/562862; Datasheet: Datasheets/resistors/PYu-RC_Group_51_RoHS_L_11.pdf; Last changed: 27.10.2022
VT27 VT30 = 2N7002,215: 60V 3A 0.35W Surface Mount SOT-23; Manufacturer: KUU Semiconductor; Place: *); Check: False; Part Number: WNM2016; Voltage: 60V; Value: WNM2016; Temperature: -65°C~150°C";; ComponentLink1Description: DATASHEET; NameFromManufacturer: WNM2016; ComponentLink1URL: https://assets.nexperia.com/documents/data-sheet/2N7002.pdf; Last changeв: 27.10.2022
VT28 VT29 = 2SK3018: N-Channel; Check: False; Part Number: 2SK3018; Value: 2SK3018; NameFromManufacturer: 2SK3018

## Sheet CPU.SchDoc
size 420 x 297 mm; SheetNumber: 9; SheetTotal: 32; DocumentTypeShort: Э3; DocumentInvertoryNumber: ㅤ
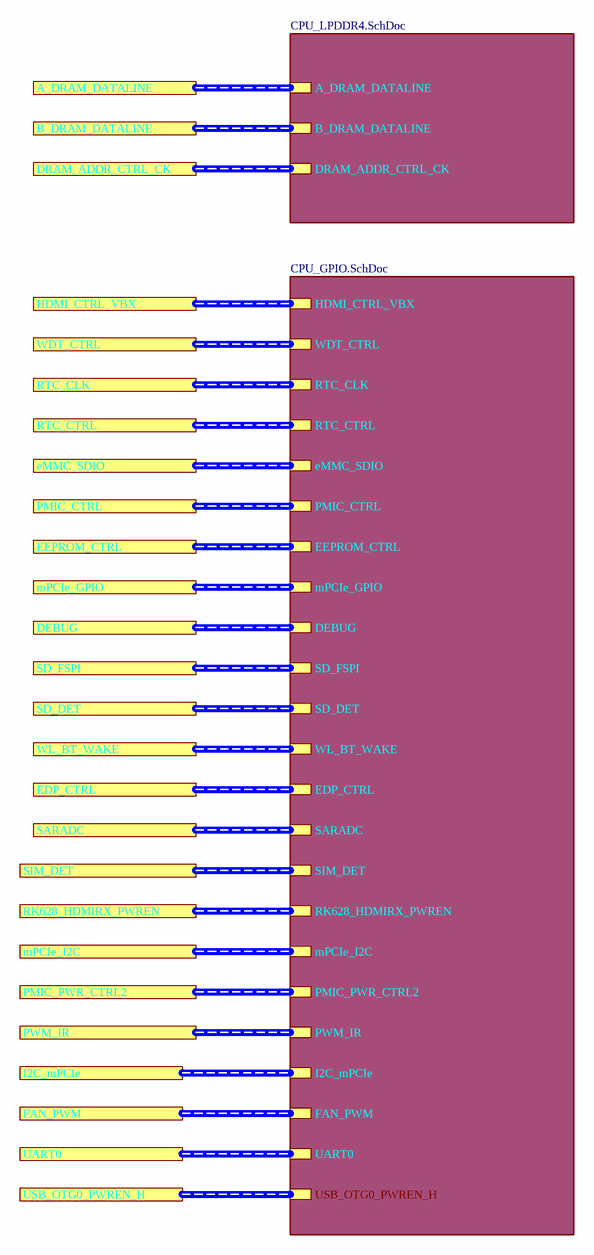
[diagram p8: CPU.SchDoc]

### Sub-sheets
CPU_GPIO = CPU_GPIO.SchDoc: HDMI_CTRL_VBX (harness HDMI_CTRL_VBX), WDT_CTRL (harness WDT_CTRL), RTC_CLK (harness RTC_CLK), RTC_CTRL (harness RTC_CTRL), eMMC_SDIO (harness eMMC_SDIO), PMIC_CTRL (harness PMIC_CTRL), EEPROM_CTRL (harness EEPROM_CTRL), SD_FSPI (harness SD_FSPI), SD_DET (harness SD_DET), WL_BT_WAKE (harness WL_BT_WAKE), EDP_CTRL (harness EDP_CTRL), SARADC (harness SARADC), mPCIe_GPIO (harness mPCIe_GPIO), SIM_DET (harness SIM_DET), mPCIe_I2C (harness mPCIe_I2C), RK628_HDMIRX_PWREN (harness RK628_HDMIRX_PWREN), PMIC_PWR_CTRL2 (harness PMIC_PWR_CTRL2), PWM_IR (harness PWM0_IR), I2C_mPCIe (harness I2C_mPCIe), DEBUG (harness DEBUG), FAN_PWM (harness FAN_PWM), UART0 (harness UART0), USB_OTG0_PWREN_H (harness USB_OTG0_PWREN_H)
CPU_LPDDR4 = CPU_LPDDR4.SchDoc: A_DRAM_DATALINE (harness A_DRAM_DATALINE), B_DRAM_DATALINE (harness B_DRAM_DATALINE), DRAM_ADDR_CTRL_CK (harness DRAM_ADDR_CTRL_CK)

### Ports
A_DRAM_DATALINE, B_DRAM_DATALINE, DEBUG, DRAM_ADDR_CTRL_CK, EDP_CTRL, EEPROM_CTRL, eMMC_SDIO, FAN_PWM, HDMI_CTRL_VBX, I2C_mPCIe, mPCIe_GPIO, mPCIe_I2C, PMIC_CTRL, PMIC_PWR_CTRL2, PWM_IR, RK628_HDMIRX_PWREN, RTC_CLK, RTC_CTRL, SARADC, SD_DET, SD_FSPI, SIM_DET, UART0, USB_OTG0_PWREN_H, WDT_CTRL, WL_BT_WAKE

### Buses and harness runs
harness port A_DRAM_DATALINE = sheet CPU_LPDDR4/A_DRAM_DATALINE
harness port B_DRAM_DATALINE = sheet CPU_LPDDR4/B_DRAM_DATALINE
harness port DEBUG = sheet CPU_GPIO/DEBUG
harness port DRAM_ADDR_CTRL_CK = sheet CPU_LPDDR4/DRAM_ADDR_CTRL_CK
harness port EDP_CTRL = sheet CPU_GPIO/EDP_CTRL
harness port EEPROM_CTRL = sheet CPU_GPIO/EEPROM_CTRL
harness port eMMC_SDIO = sheet CPU_GPIO/eMMC_SDIO
harness port FAN_PWM = sheet CPU_GPIO/FAN_PWM
harness port HDMI_CTRL_VBX = sheet CPU_GPIO/HDMI_CTRL_VBX
harness port I2C_mPCIe = sheet CPU_GPIO/I2C_mPCIe
harness port mPCIe_GPIO = sheet CPU_GPIO/mPCIe_GPIO
harness port mPCIe_I2C = sheet CPU_GPIO/mPCIe_I2C
harness port PMIC_CTRL = sheet CPU_GPIO/PMIC_CTRL
harness port PMIC_PWR_CTRL2 = sheet CPU_GPIO/PMIC_PWR_CTRL2
harness port PWM_IR = sheet CPU_GPIO/PWM_IR
harness port RK628_HDMIRX_PWREN = sheet CPU_GPIO/RK628_HDMIRX_PWREN
harness port RTC_CLK = sheet CPU_GPIO/RTC_CLK
harness port RTC_CTRL = sheet CPU_GPIO/RTC_CTRL
harness port SARADC = sheet CPU_GPIO/SARADC
harness port SD_DET = sheet CPU_GPIO/SD_DET
harness port SD_FSPI = sheet CPU_GPIO/SD_FSPI
harness port SIM_DET = sheet CPU_GPIO/SIM_DET
harness port UART0 = sheet CPU_GPIO/UART0
harness port USB_OTG0_PWREN_H = sheet CPU_GPIO/USB_OTG0_PWREN_H
harness port WDT_CTRL = sheet CPU_GPIO/WDT_CTRL
harness port WL_BT_WAKE = sheet CPU_GPIO/WL_BT_WAKE

### Notes on the sheet
- Подп. и дата
- Инв. № дубл.
- Взам. инв. №
- Инв. № подл.
- Изм.
- Лист
- № докум.
- Подп.
- Дата
- Копировал
- Формат А3

## Sheet CPU_LPDDR4.SchDoc
size 420 x 297 mm; Title1str: Модуль; Title2str: ATB-LW-USB-GateWay; Mass: ---; Letter1Column: О; Letter2Column: {L}; DocumentType1str: {Документ}; DocumentType2str: {Документ}; SpravNomer: {Справ. №}; PageSetup: Record=PageOptions|CenterHorizontal=False|CenterVertical=False|PrintScale=0.95|XCorrection=0.00|YCorrection=0.00|PrintKind=1|BorderSize=5000000|LeftOffset=0|BottomOffset=0|Orientation=1|PaperLength=1000|PaperWidth=1000|Scale=100|PaperSource=15|PrintQuality=600|MediaType=1|DitherType=10|PaperKind=A4|PrintScaleMode=1; Scale: 1:1; DocumentType: Схема электрическая принципиальная; SheetNumber: 10; SheetTotal: 32; DocumentTypeShort: Э3; DocumentInvertoryNumber: ㅤ
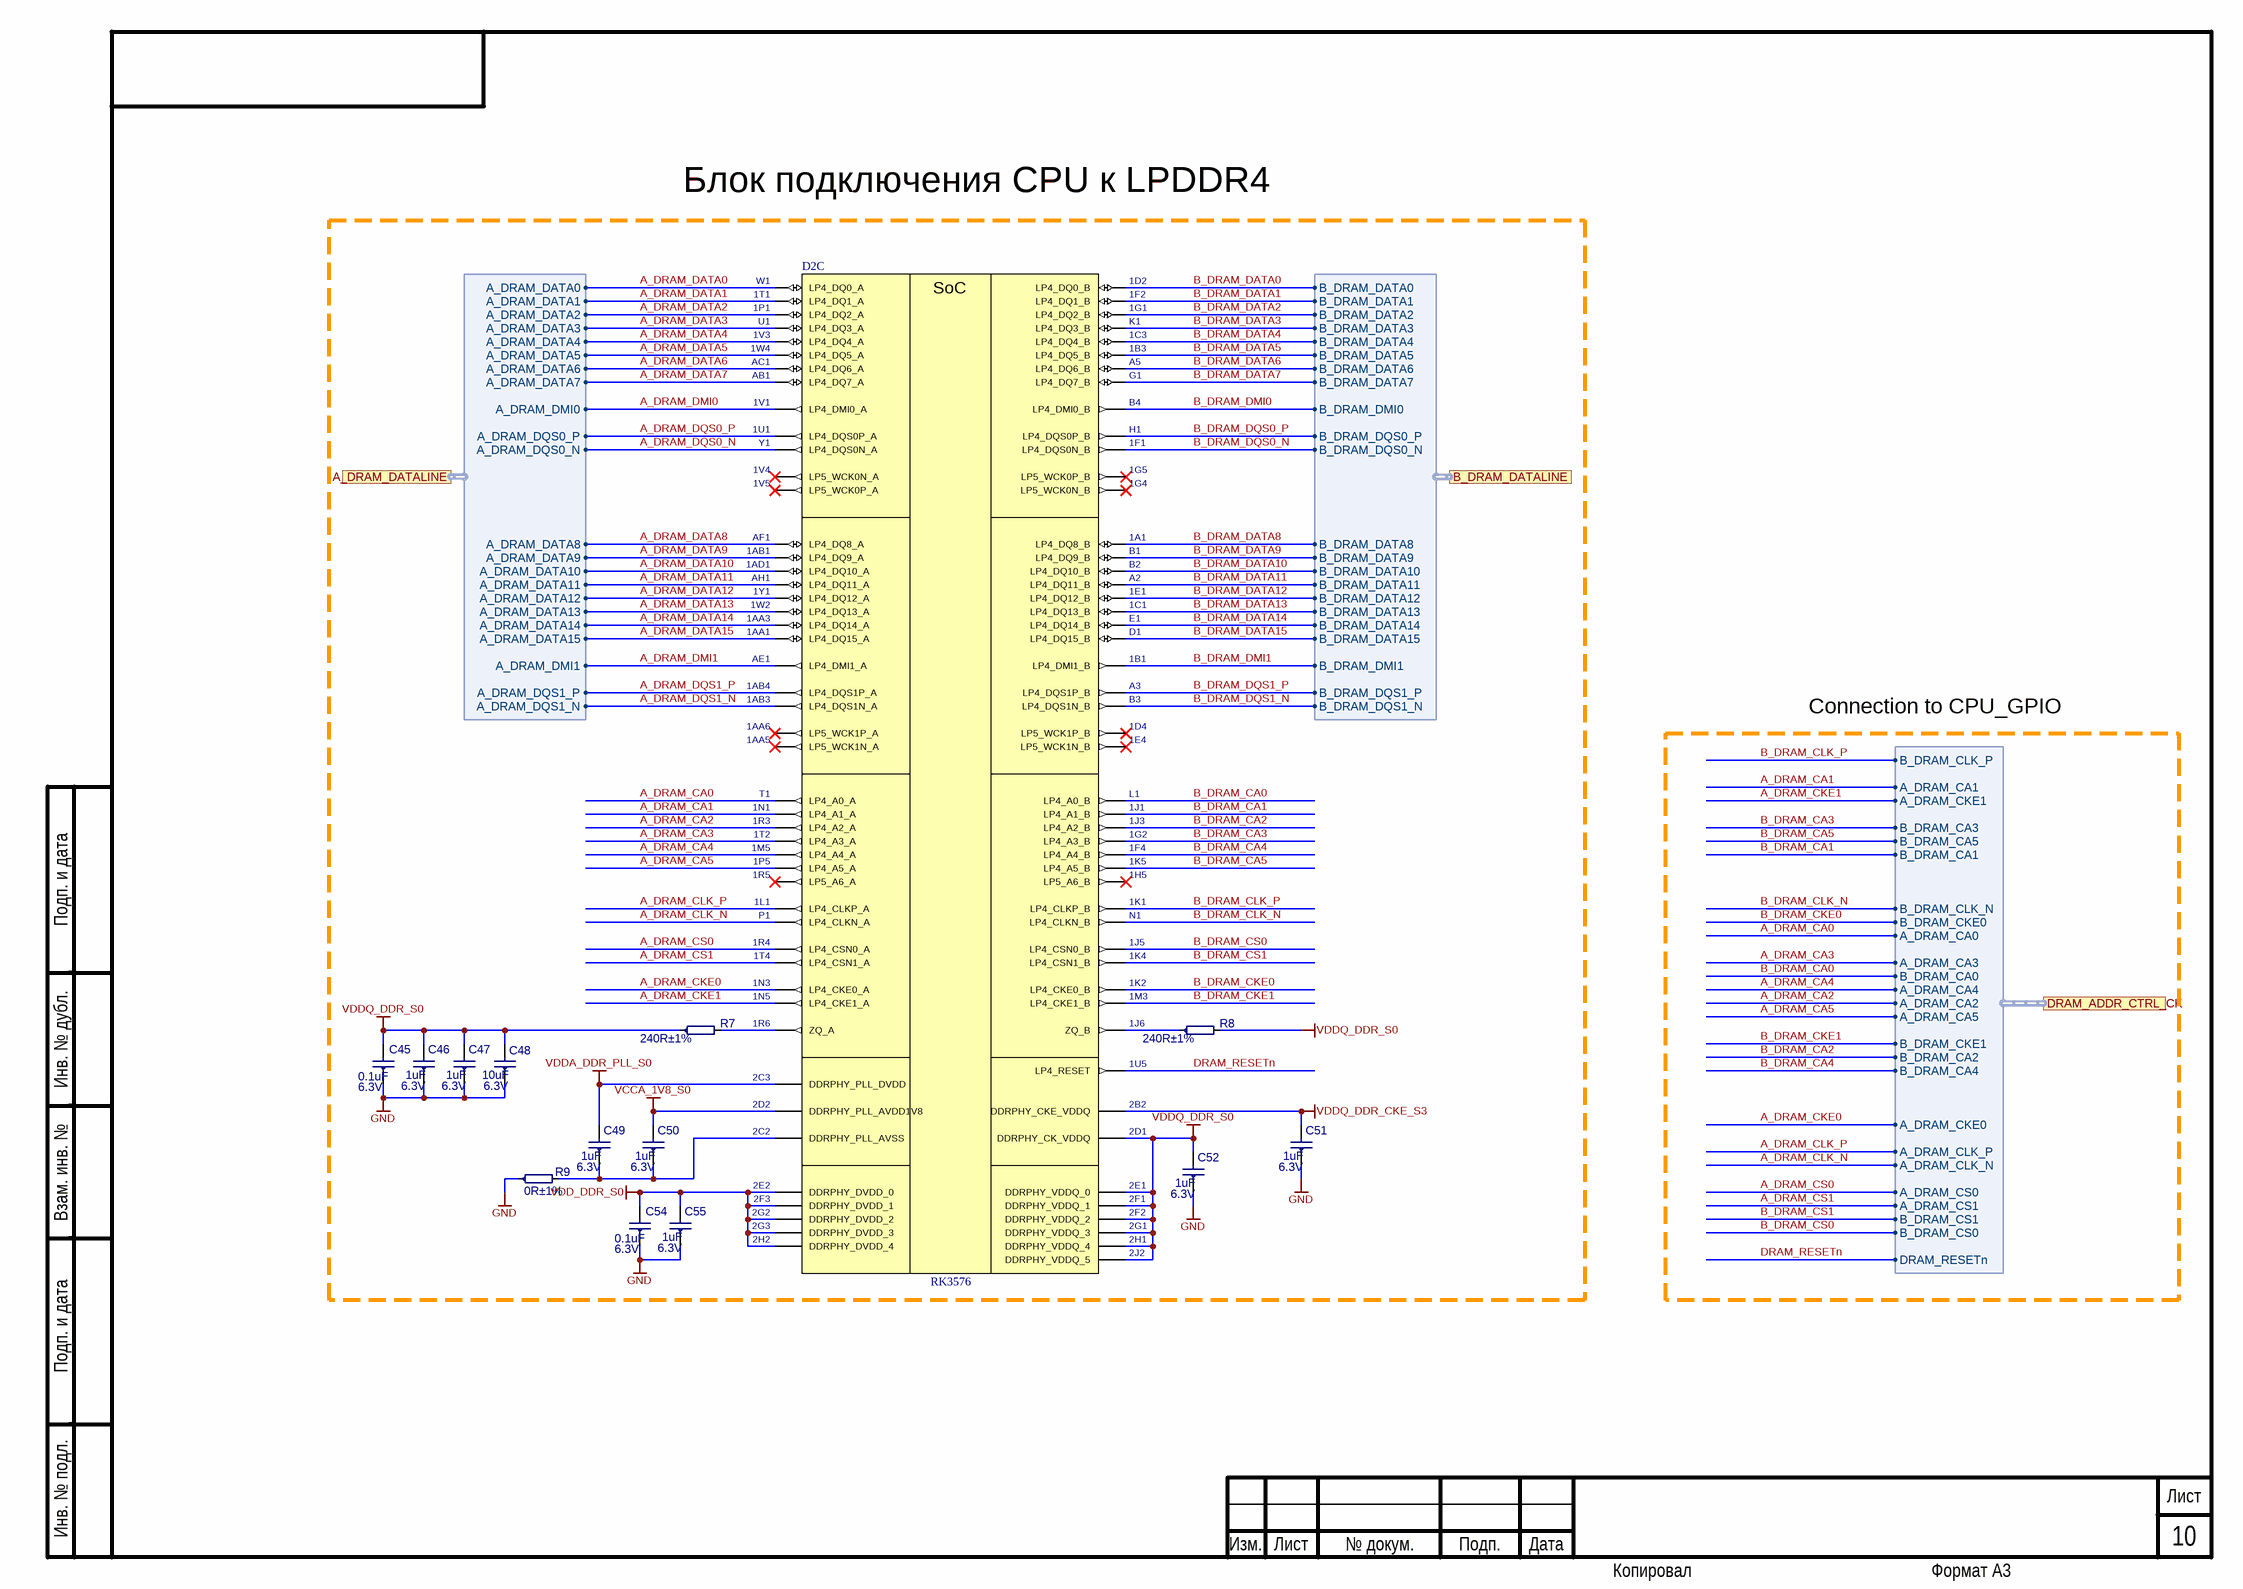
[diagram p9: CPU_LPDDR4.SchDoc]

### Parts
C45  0.1uF  Voltage: 6.3V  [C0201]
C46  1uF  Voltage: 6.3V  [C0201]
C47  1uF  Voltage: 6.3V  [C0201]
C48  10uF  Voltage: 6.3V  [C0402]
C49  1uF  Voltage: 6.3V  [C0201]
C50  1uF  Voltage: 6.3V  [C0201]
C51  1uF  Voltage: 6.3V  [C0201]
C52  1uF  Voltage: 6.3V  [C0201]
C54  0.1uF  Voltage: 6.3V  [C0201]
C55  1uF  Voltage: 6.3V  [C0201]
D2  RK3576  [BGAFCCSP698L]  (part C of 7)
R7  240R±1%  [R0201]
R8  240R±1%  [R0201]
R9  0R±1%  [R0402]

### Ports
A_DRAM_DATALINE (harness A_DRAM_DATALINE), B_DRAM_DATALINE (harness B_DRAM_DATALINE), DRAM_ADDR_CTRL_CK (harness DRAM_ADDR_CTRL_CK)

### Harnesses
A_DRAM_DATALINE: A_DRAM_DATA0, A_DRAM_DATA1, A_DRAM_DATA2, A_DRAM_DATA3, A_DRAM_DATA4, A_DRAM_DATA5, A_DRAM_DATA6, A_DRAM_DATA7, A_DRAM_DATA8, A_DRAM_DATA9, A_DRAM_DATA10, A_DRAM_DATA11, A_DRAM_DATA12, A_DRAM_DATA13, A_DRAM_DATA15, A_DRAM_DATA14, A_DRAM_DMI0, A_DRAM_DMI1, A_DRAM_DQS0_P, A_DRAM_DQS0_N, A_DRAM_DQS1_P, A_DRAM_DQS1_N
B_DRAM_DATALINE: B_DRAM_DATA0, B_DRAM_DATA1, B_DRAM_DATA2, B_DRAM_DATA3, B_DRAM_DATA4, B_DRAM_DATA5, B_DRAM_DATA6, B_DRAM_DATA7, B_DRAM_DATA9, B_DRAM_DATA10, B_DRAM_DATA11, B_DRAM_DATA12, B_DRAM_DATA13, B_DRAM_DATA15, B_DRAM_DATA14, B_DRAM_DMI1, B_DRAM_DMI0, B_DRAM_DQS0_P, B_DRAM_DQS0_N, B_DRAM_DQS1_N, B_DRAM_DQS1_P, B_DRAM_DATA8
DRAM_ADDR_CTRL_CK: A_DRAM_CA5, B_DRAM_CKE1, B_DRAM_CA2, A_DRAM_CLK_P, B_DRAM_CLK_N, A_DRAM_CA3, A_DRAM_CKE0, B_DRAM_CA0, B_DRAM_CKE0, DRAM_RESETn, A_DRAM_CA4, B_DRAM_CA1, A_DRAM_CKE1, B_DRAM_CA3, B_DRAM_CLK_P, A_DRAM_CLK_N, B_DRAM_CA5, A_DRAM_CA0, A_DRAM_CA1, A_DRAM_CA2, B_DRAM_CA4, A_DRAM_CS0, A_DRAM_CS1, B_DRAM_CS1, B_DRAM_CS0

### Nets
GND: C45.1 C46.1 C47.1 C48.1 C51.1 C52.1 C54.1 C55.1 R9.1
VCCA_1V8_S0: C50.2 D2.2D2(DDRPHY_PLL_AVDD1V8)
VDD_DDR_S0: C54.2 C55.2 D2.2E2(DDRPHY_DVDD_0) D2.2F3(DDRPHY_DVDD_1) D2.2G2(DDRPHY_DVDD_2) D2.2G3(DDRPHY_DVDD_3) D2.2H2(DDRPHY_DVDD_4)
VDDA_DDR_PLL_S0: C49.2 D2.2C3(DDRPHY_PLL_DVDD)
VDDQ_DDR_CKE_S3: C51.2 D2.2B2(DDRPHY_CKE_VDDQ)
VDDQ_DDR_S0: C45.2 C46.2 C47.2 C48.2 C52.2 D2.2D1(DDRPHY_CK_VDDQ) D2.2E1(DDRPHY_VDDQ_0) D2.2F1(DDRPHY_VDDQ_1) D2.2F2(DDRPHY_VDDQ_2) D2.2G1(DDRPHY_VDDQ_3) D2.2H1(DDRPHY_VDDQ_4) D2.2J2(DDRPHY_VDDQ_5) R7.1 R8.2
A_DRAM_CA0: D2.T1(LP4_A0_A) ; port DRAM_ADDR_CTRL_CK.A_DRAM_CA0
A_DRAM_CA1: D2.1N1(LP4_A1_A) ; port DRAM_ADDR_CTRL_CK.A_DRAM_CA1
A_DRAM_CA2: D2.1R3(LP4_A2_A) ; port DRAM_ADDR_CTRL_CK.A_DRAM_CA2
A_DRAM_CA3: D2.1T2(LP4_A3_A) ; port DRAM_ADDR_CTRL_CK.A_DRAM_CA3
A_DRAM_CA4: D2.1M5(LP4_A4_A) ; port DRAM_ADDR_CTRL_CK.A_DRAM_CA4
A_DRAM_CA5: D2.1P5(LP4_A5_A) ; port DRAM_ADDR_CTRL_CK.A_DRAM_CA5
A_DRAM_CKE0: D2.1N3(LP4_CKE0_A) ; port DRAM_ADDR_CTRL_CK.A_DRAM_CKE0
A_DRAM_CKE1: D2.1N5(LP4_CKE1_A) ; port DRAM_ADDR_CTRL_CK.A_DRAM_CKE1
A_DRAM_CLK_N: D2.P1(LP4_CLKN_A) ; port DRAM_ADDR_CTRL_CK.A_DRAM_CLK_N
A_DRAM_CLK_P: D2.1L1(LP4_CLKP_A) ; port DRAM_ADDR_CTRL_CK.A_DRAM_CLK_P
A_DRAM_CS0: D2.1R4(LP4_CSN0_A) ; port DRAM_ADDR_CTRL_CK.A_DRAM_CS0
A_DRAM_CS1: D2.1T4(LP4_CSN1_A) ; port DRAM_ADDR_CTRL_CK.A_DRAM_CS1
A_DRAM_DATA0: D2.W1(LP4_DQ0_A) ; port A_DRAM_DATALINE.A_DRAM_DATA0
A_DRAM_DATA1: D2.1T1(LP4_DQ1_A) ; port A_DRAM_DATALINE.A_DRAM_DATA1
A_DRAM_DATA2: D2.1P1(LP4_DQ2_A) ; port A_DRAM_DATALINE.A_DRAM_DATA2
A_DRAM_DATA3: D2.U1(LP4_DQ3_A) ; port A_DRAM_DATALINE.A_DRAM_DATA3
A_DRAM_DATA4: D2.1V3(LP4_DQ4_A) ; port A_DRAM_DATALINE.A_DRAM_DATA4
A_DRAM_DATA5: D2.1W4(LP4_DQ5_A) ; port A_DRAM_DATALINE.A_DRAM_DATA5
A_DRAM_DATA6: D2.AC1(LP4_DQ6_A) ; port A_DRAM_DATALINE.A_DRAM_DATA6
A_DRAM_DATA7: D2.AB1(LP4_DQ7_A) ; port A_DRAM_DATALINE.A_DRAM_DATA7
A_DRAM_DATA8: D2.AF1(LP4_DQ8_A) ; port A_DRAM_DATALINE.A_DRAM_DATA8
A_DRAM_DATA9: D2.1AB1(LP4_DQ9_A) ; port A_DRAM_DATALINE.A_DRAM_DATA9
A_DRAM_DATA10: D2.1AD1(LP4_DQ10_A) ; port A_DRAM_DATALINE.A_DRAM_DATA10
A_DRAM_DATA11: D2.AH1(LP4_DQ11_A) ; port A_DRAM_DATALINE.A_DRAM_DATA11
A_DRAM_DATA12: D2.1Y1(LP4_DQ12_A) ; port A_DRAM_DATALINE.A_DRAM_DATA12
A_DRAM_DATA13: D2.1W2(LP4_DQ13_A) ; port A_DRAM_DATALINE.A_DRAM_DATA13
A_DRAM_DATA14: D2.1AA3(LP4_DQ14_A) ; port A_DRAM_DATALINE.A_DRAM_DATA14
A_DRAM_DATA15: D2.1AA1(LP4_DQ15_A) ; port A_DRAM_DATALINE.A_DRAM_DATA15
A_DRAM_DMI0: D2.1V1(LP4_DMI0_A) ; port A_DRAM_DATALINE.A_DRAM_DMI0  [project net A_DRAM_DATALINE.A_DRAM_DMI0]
A_DRAM_DMI1: D2.AE1(LP4_DMI1_A) ; port A_DRAM_DATALINE.A_DRAM_DMI1  [project net A_DRAM_DATALINE.A_DRAM_DMI1]
A_DRAM_DQS0_N: D2.Y1(LP4_DQS0N_A) ; port A_DRAM_DATALINE.A_DRAM_DQS0_N  [project net A_DRAM_DATALINE.A_DRAM_DQS0_N]
A_DRAM_DQS0_P: D2.1U1(LP4_DQS0P_A) ; port A_DRAM_DATALINE.A_DRAM_DQS0_P  [project net A_DRAM_DATALINE.A_DRAM_DQS0_P]
A_DRAM_DQS1_N: D2.1AB3(LP4_DQS1N_A) ; port A_DRAM_DATALINE.A_DRAM_DQS1_N  [project net A_DRAM_DATALINE.A_DRAM_DQS1_N]
A_DRAM_DQS1_P: D2.1AB4(LP4_DQS1P_A) ; port A_DRAM_DATALINE.A_DRAM_DQS1_P  [project net A_DRAM_DATALINE.A_DRAM_DQS1_P]
B_DRAM_CA0: D2.L1(LP4_A0_B) ; port DRAM_ADDR_CTRL_CK.B_DRAM_CA0
B_DRAM_CA1: D2.1J1(LP4_A1_B) ; port DRAM_ADDR_CTRL_CK.B_DRAM_CA1
B_DRAM_CA2: D2.1J3(LP4_A2_B) ; port DRAM_ADDR_CTRL_CK.B_DRAM_CA2
B_DRAM_CA3: D2.1G2(LP4_A3_B) ; port DRAM_ADDR_CTRL_CK.B_DRAM_CA3
B_DRAM_CA4: D2.1F4(LP4_A4_B) ; port DRAM_ADDR_CTRL_CK.B_DRAM_CA4
B_DRAM_CA5: D2.1K5(LP4_A5_B) ; port DRAM_ADDR_CTRL_CK.B_DRAM_CA5
B_DRAM_CKE0: D2.1K2(LP4_CKE0_B) ; port DRAM_ADDR_CTRL_CK.B_DRAM_CKE0
B_DRAM_CKE1: D2.1M3(LP4_CKE1_B) ; port DRAM_ADDR_CTRL_CK.B_DRAM_CKE1
B_DRAM_CLK_N: D2.N1(LP4_CLKN_B) ; port DRAM_ADDR_CTRL_CK.B_DRAM_CLK_N
B_DRAM_CLK_P: D2.1K1(LP4_CLKP_B) ; port DRAM_ADDR_CTRL_CK.B_DRAM_CLK_P
B_DRAM_CS0: D2.1J5(LP4_CSN0_B) ; port DRAM_ADDR_CTRL_CK.B_DRAM_CS0
B_DRAM_CS1: D2.1K4(LP4_CSN1_B) ; port DRAM_ADDR_CTRL_CK.B_DRAM_CS1
B_DRAM_DATA0: D2.1D2(LP4_DQ0_B) ; port B_DRAM_DATALINE.B_DRAM_DATA0
B_DRAM_DATA1: D2.1F2(LP4_DQ1_B) ; port B_DRAM_DATALINE.B_DRAM_DATA1
B_DRAM_DATA2: D2.1G1(LP4_DQ2_B) ; port B_DRAM_DATALINE.B_DRAM_DATA2
B_DRAM_DATA3: D2.K1(LP4_DQ3_B) ; port B_DRAM_DATALINE.B_DRAM_DATA3
B_DRAM_DATA4: D2.1C3(LP4_DQ4_B) ; port B_DRAM_DATALINE.B_DRAM_DATA4
B_DRAM_DATA5: D2.1B3(LP4_DQ5_B) ; port B_DRAM_DATALINE.B_DRAM_DATA5
B_DRAM_DATA6: D2.A5(LP4_DQ6_B) ; port B_DRAM_DATALINE.B_DRAM_DATA6
B_DRAM_DATA7: D2.G1(LP4_DQ7_B) ; port B_DRAM_DATALINE.B_DRAM_DATA7
B_DRAM_DATA8: D2.1A1(LP4_DQ8_B) ; port B_DRAM_DATALINE.B_DRAM_DATA8
B_DRAM_DATA9: D2.B1(LP4_DQ9_B) ; port B_DRAM_DATALINE.B_DRAM_DATA9
B_DRAM_DATA10: D2.B2(LP4_DQ10_B) ; port B_DRAM_DATALINE.B_DRAM_DATA10
B_DRAM_DATA11: D2.A2(LP4_DQ11_B) ; port B_DRAM_DATALINE.B_DRAM_DATA11
B_DRAM_DATA12: D2.1E1(LP4_DQ12_B) ; port B_DRAM_DATALINE.B_DRAM_DATA12
B_DRAM_DATA13: D2.1C1(LP4_DQ13_B) ; port B_DRAM_DATALINE.B_DRAM_DATA13
B_DRAM_DATA14: D2.E1(LP4_DQ14_B) ; port B_DRAM_DATALINE.B_DRAM_DATA14
B_DRAM_DATA15: D2.D1(LP4_DQ15_B) ; port B_DRAM_DATALINE.B_DRAM_DATA15
B_DRAM_DMI0: D2.B4(LP4_DMI0_B) ; port B_DRAM_DATALINE.B_DRAM_DMI0  [project net B_DRAM_DATALINE.B_DRAM_DMI0]
B_DRAM_DMI1: D2.1B1(LP4_DMI1_B) ; port B_DRAM_DATALINE.B_DRAM_DMI1  [project net B_DRAM_DATALINE.B_DRAM_DMI1]
B_DRAM_DQS0_N: D2.1F1(LP4_DQS0N_B) ; port B_DRAM_DATALINE.B_DRAM_DQS0_N  [project net B_DRAM_DATALINE.B_DRAM_DQS0_N]
B_DRAM_DQS0_P: D2.H1(LP4_DQS0P_B) ; port B_DRAM_DATALINE.B_DRAM_DQS0_P  [project net B_DRAM_DATALINE.B_DRAM_DQS0_P]
B_DRAM_DQS1_N: D2.B3(LP4_DQS1N_B) ; port B_DRAM_DATALINE.B_DRAM_DQS1_N  [project net B_DRAM_DATALINE.B_DRAM_DQS1_N]
B_DRAM_DQS1_P: D2.A3(LP4_DQS1P_B) ; port B_DRAM_DATALINE.B_DRAM_DQS1_P  [project net B_DRAM_DATALINE.B_DRAM_DQS1_P]
DRAM_RESETn: D2.1U5(LP4_RESET) ; port DRAM_ADDR_CTRL_CK.DRAM_RESETn  [project net DRAM_ADDR_CTRL_CK.DRAM_RESETn]
NetC49_1: C49.1 C50.1 D2.2C2(DDRPHY_PLL_AVSS) R9.2
NetD2_1J6: D2.1J6(ZQ_B) R8.1
NetD2_1R6: D2.1R6(ZQ_A) R7.2

Not connected (* = marked no-connect by the designer): D2 1AA5(LP5_WCK1N_A)* 1AA6(LP5_WCK1P_A)* 1D4(LP5_WCK1P_B)* 1E4(LP5_WCK1N_B)* 1G4(LP5_WCK0N_B)* 1G5(LP5_WCK0P_B)* 1H5(LP5_A6_B)* 1R5(LP5_A6_A)* 1V4(LP5_WCK0N_A)* 1V5(LP5_WCK0P_A)*

### Notes on the sheet
- Блок подключения CPU к LPDDR4
- Connection to CPU_GPIO
- Подп. и дата
- Инв. № дубл.
- Взам. инв. №
- Инв. № подл.
- Изм.
- Лист
- № докум.
- Подп.
- Дата
- Копировал
- Формат А3
- (in symbol RK3576, part C) SoC

### Library data of the parts
C45 C54 = 0201-X5R-6.3V-0.1uF±10%: Manufacturer: Yageo; NameFromManufacturer: CC0201KRX5R5BB104; Dielectric: X5R; Place: *); Tolerance: 10%; Check: False; Case: C0201; Part Number: 0201-X5R-6.3V-0.1uF±10%; Value: 0.1uF; Temperature: -55°C~85°C; ComponentLink2Description: Link to datasheet; ComponentLink1Description: DATASHEET; ComponentLink2URL: https://www.terraelectronica.ru/product/1020032; ComponentLink1URL: Datasheets/capacitors/UPY-GPHC_X5R_4V-to-50V_27.pdf; Last changed: 27.10.2022
C46 C47 C49-C52 C55 = 0201-X5R-6.3V-1uF±20%: as C127-C129 on sheet PWR_CPU; Case: C0201; Part Number: 0201-X5R-6.3V-1uF±20%; Value: 1uF; Temperature: -55°C~85°C; ComponentLink2Description: Link to datasheet; ComponentLink1Description: DATASHEET; ComponentLink2URL: https://www.terraelectronica.ru/product/1209278; ComponentLink1URL: Datasheets/capacitors/GRM033R60J105MEA2-61A.pdf; Last changed: 27.10.2022
C48 = 0402-X5R-6.3V-10uF±20%: Manufacturer: Yageo; NameFromManufacturer: CC0402MRX5R5BB106; Dielectric: X5R; Place: *); Tolerance: 20%; Check: False; Case: C0402; Part Number: 0402-X5R-6.3V-10uF±20%; Value: 10uF; Temperature: -55°C~125°C; ComponentLink2Description: Link to datasheet; ComponentLink1Description: DATASHEET; ComponentLink2URL: https://ru.mouser.com/ProductDetail/YAGEO/CC0402MRX5R5BB106?qs=%2Fha2pyFadujQAk9rG2cgJj8l7IbODD3KVaDjvxAcKzu9LtlLnRlq6Q%3D%3D; ComponentLink1URL: Datasheets/capacitors/UPY-GPHC_X5R_4V-to-50V_27.pdf; Last changed: 27.10.2022
D2 = RK3576: SoC 4xCortex-A72@2.2Ghz+4xCortex-A53@2Ghz, LPDDR4/4X/5/5X, SDIO/eMMC/UFS/FSPI, BGA 16.1x17.2x1.0mm; Manufacturer: Rockship; Place: *); Check: False; Part Number: RK3576; Temperature: -40°C~85°C; Value: RK3576; ComponentLink1Description: DATASHEET; NameFromManufacturer: RK3576; ComponentLink1URL: https://wiki.friendlyelec.com/wiki/images/b/bf/Rockchip_RK3576_Datasheet_V1.5-20241216.pdf; Last changed: 06.01.2026
R7 R8 = 0201-0.05W-0R-100ppm-5%: *; Part Number: 0201-0.05W-240R-100ppm-5%; NameFromManufacturer: RC0201FR-07240RL; Manufacturer: Yageo; Place: *); Value: 240R; Tolerance: 1%; Check: False; Case: R0201; Temperature: -40°C~125°C; ComponentLink1Description: DATASHEET; ComponentLink1URL: https://www.digikey.com/en/products/detail/yageo/RC0201JR-070RL/1948898; Datasheet: Datasheets/resistors/PYu-RC_Group_51_RoHS_L_11.pdf+BB3:B271; Last changed: 27.10.2022
R9 = 0402-0.0625W-0R-100ppm±1%: as R344 on sheet PWR_PoE_PD_1000BASE-T; Case: R0402; Part Number: 0402-0.0625W-0R-100ppm±1%; Tolerance: 1%; Temperature: -55°C~155°C; ComponentLink1Description: DATASHEET; ComponentLink1URL: https://www.chipdip.ru/product0/8000617426?ysclid=l7og5x0plo427794326; Datasheet: Datasheets/resistors/DOC012445956.pdf; Last changed: 27.10.2022